# EAGLE schematic display_array (EAGLE 7.5.0)
DRAWING_NUMBER: S001; DRAWN: Mario Blunk / Blunk electronic; PROJECT: CLOCK; STATUS: DEMO

## Sheet 1 of 16
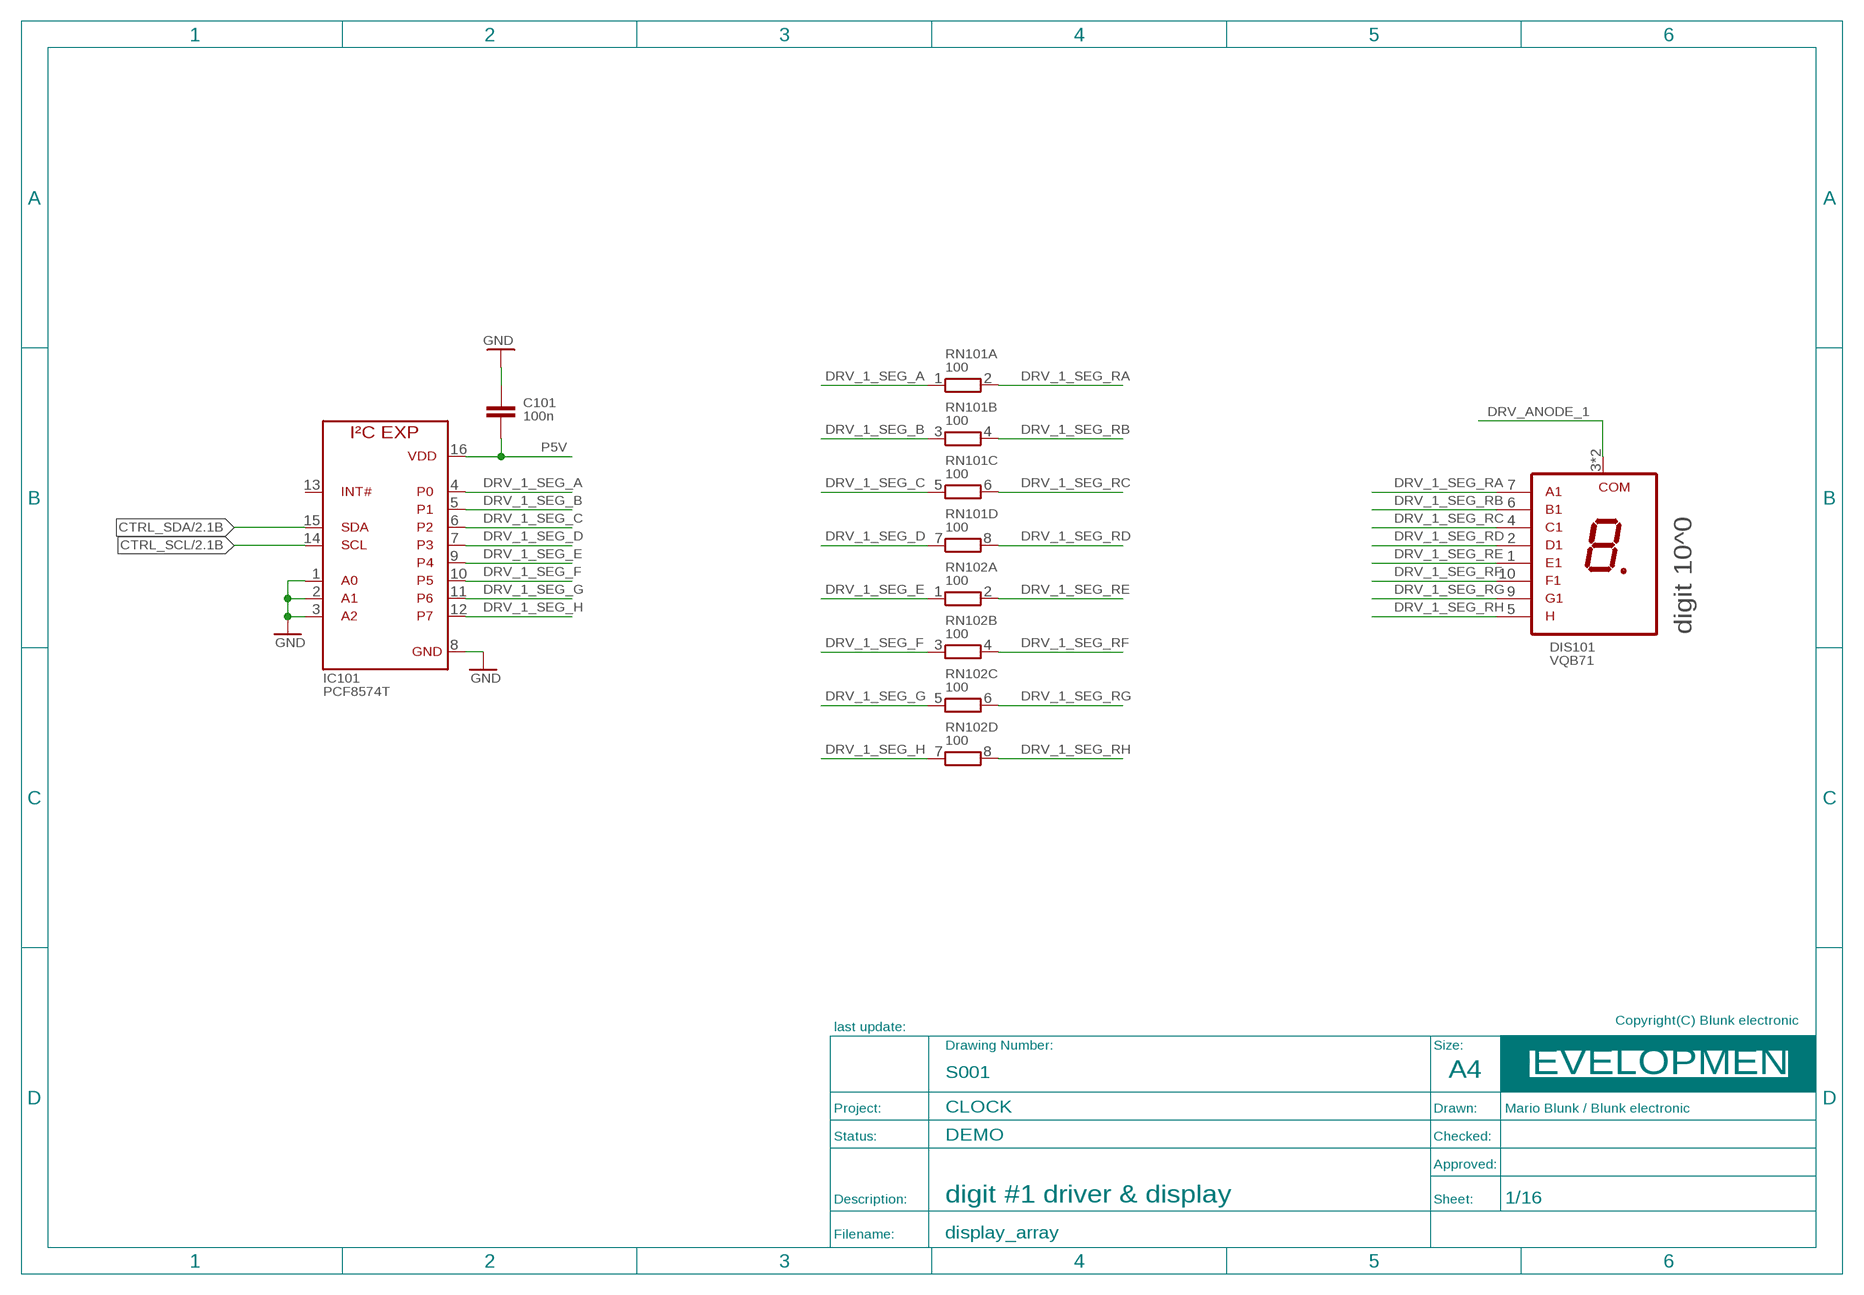
[diagram p0: schematic, sheet 1]
FRAME_PRODUCT1 (A4_LANDSCAPE_DEVELOPMENT): BOM: NO; COMMISSIONED: 2013-08-30; DESCRIPTION: digit #1 driver & display

### Parts
C101  100n  C_EU_S_0805  [S_0805]
DIS101  VQB71  [T_VQB71]
IC101  PCF8574T  [S_SOIC16]
RN101  100  R_EU_ARRAY_4  [T_SIL8]
RN102  100  R_EU_ARRAY_4  [T_SIL8]

### Nets
CTRL_SCL: IC101.14(SCL) ; also sheet 2,3,4,5,6,7,8,9,10,14
CTRL_SDA: IC101.15(SDA) ; also sheet 2,3,4,5,6,7,8,9,10,14
DRV_1_SEG_A: IC101.4(P0) RN101.1
DRV_1_SEG_B: IC101.5(P1) RN101.3
DRV_1_SEG_C: IC101.6(P2) RN101.5
DRV_1_SEG_D: IC101.7(P3) RN101.7
DRV_1_SEG_E: IC101.9(P4) RN102.1
DRV_1_SEG_F: IC101.10(P5) RN102.3
DRV_1_SEG_G: IC101.11(P6) RN102.5
DRV_1_SEG_H: IC101.12(P7) RN102.7
DRV_1_SEG_RA: DIS101.7(A1) RN101.2
DRV_1_SEG_RB: DIS101.6(B1) RN101.4
DRV_1_SEG_RC: DIS101.4(C1) RN101.6
DRV_1_SEG_RD: DIS101.2(D1) RN101.8
DRV_1_SEG_RE: DIS101.1(E1) RN102.2
DRV_1_SEG_RF: DIS101.10(F1) RN102.4
DRV_1_SEG_RG: DIS101.9(G1) RN102.6
DRV_1_SEG_RH: DIS101.5(DP1) RN102.8
DRV_ANODE_1 [pwr]: DIS101.3(COM1) DIS101.8(COM1) ; also sheet 2,3,4,9,16
GND [pwr]: C101.1 IC101.1(A0) IC101.2(A1) IC101.3(A2) IC101.8(GND) ; also sheet 2,3,4,5,6,7,8,9,10,11,12,13,14,15,16
P5V [pwr]: C101.2 IC101.16(VDD) ; also sheet 2,3,4,5,6,7,8,9,10,12,13,14,16
Unconnected: IC101.13(!INT)

## Sheet 2 of 16
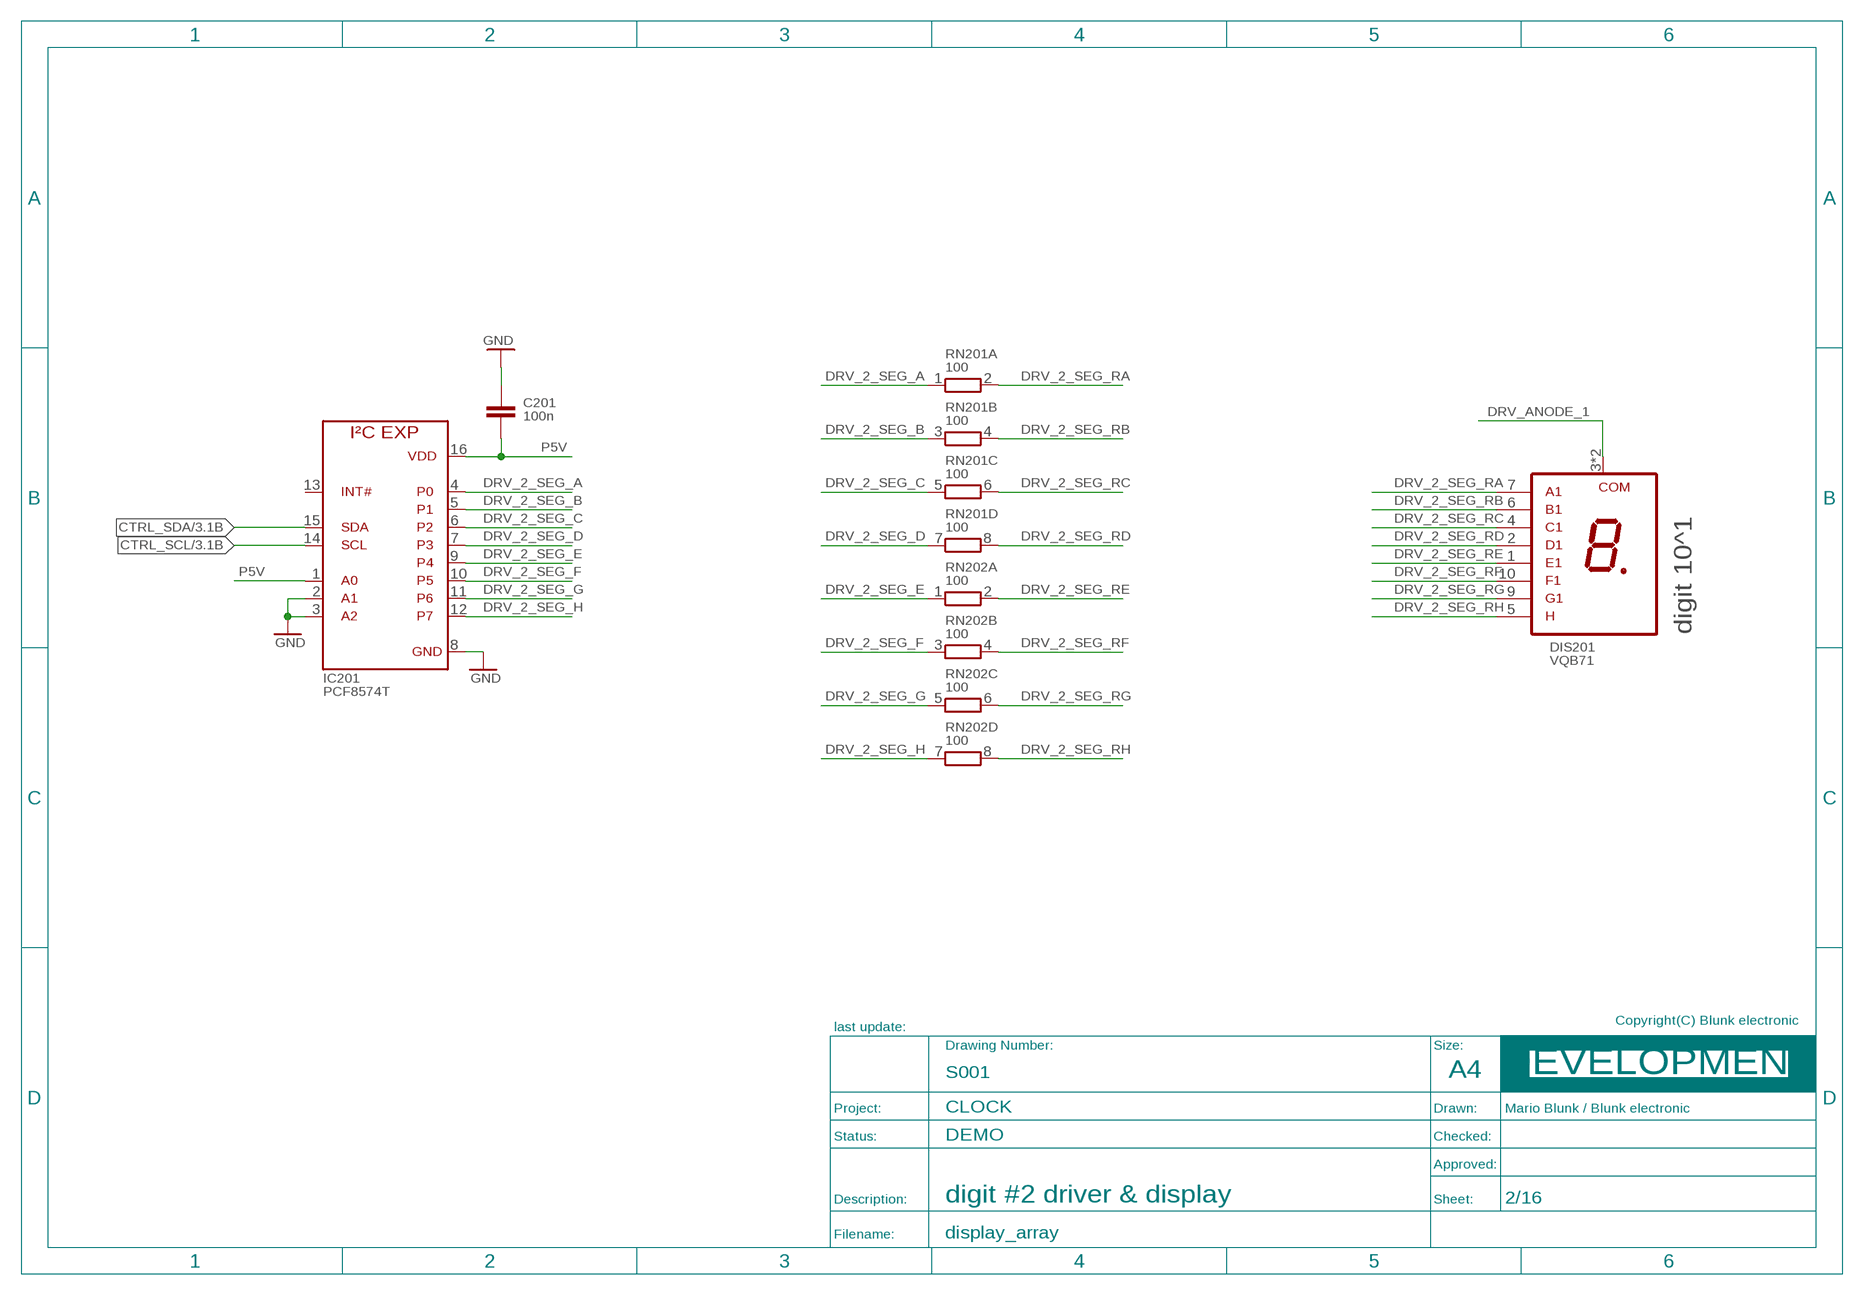
[diagram p1: schematic, sheet 2]
FRAME_PRODUCT2 (A4_LANDSCAPE_DEVELOPMENT): BOM: NO; COMMISSIONED: 2013-08-30; DESCRIPTION: digit #2 driver & display

### Parts
C201  100n  C_EU_S_0805  [S_0805]
DIS201  VQB71  [T_VQB71]
IC201  PCF8574T  [S_SOIC16]
RN201  100  R_EU_ARRAY_4  [T_SIL8]
RN202  100  R_EU_ARRAY_4  [T_SIL8]

### Nets
CTRL_SCL: IC201.14(SCL) ; also sheet 1,3,4,5,6,7,8,9,10,14
CTRL_SDA: IC201.15(SDA) ; also sheet 1,3,4,5,6,7,8,9,10,14
DRV_2_SEG_A: IC201.4(P0) RN201.1
DRV_2_SEG_B: IC201.5(P1) RN201.3
DRV_2_SEG_C: IC201.6(P2) RN201.5
DRV_2_SEG_D: IC201.7(P3) RN201.7
DRV_2_SEG_E: IC201.9(P4) RN202.1
DRV_2_SEG_F: IC201.10(P5) RN202.3
DRV_2_SEG_G: IC201.11(P6) RN202.5
DRV_2_SEG_H: IC201.12(P7) RN202.7
DRV_2_SEG_RA: DIS201.7(A1) RN201.2
DRV_2_SEG_RB: DIS201.6(B1) RN201.4
DRV_2_SEG_RC: DIS201.4(C1) RN201.6
DRV_2_SEG_RD: DIS201.2(D1) RN201.8
DRV_2_SEG_RE: DIS201.1(E1) RN202.2
DRV_2_SEG_RF: DIS201.10(F1) RN202.4
DRV_2_SEG_RG: DIS201.9(G1) RN202.6
DRV_2_SEG_RH: DIS201.5(DP1) RN202.8
DRV_ANODE_1 [pwr]: DIS201.3(COM1) DIS201.8(COM1) ; also sheet 1,3,4,9,16
GND [pwr]: C201.1 IC201.2(A1) IC201.3(A2) IC201.8(GND) ; also sheet 1,3,4,5,6,7,8,9,10,11,12,13,14,15,16
P5V [pwr]: C201.2 IC201.1(A0) IC201.16(VDD) ; also sheet 1,3,4,5,6,7,8,9,10,12,13,14,16
Unconnected: IC201.13(!INT)

## Sheet 3 of 16
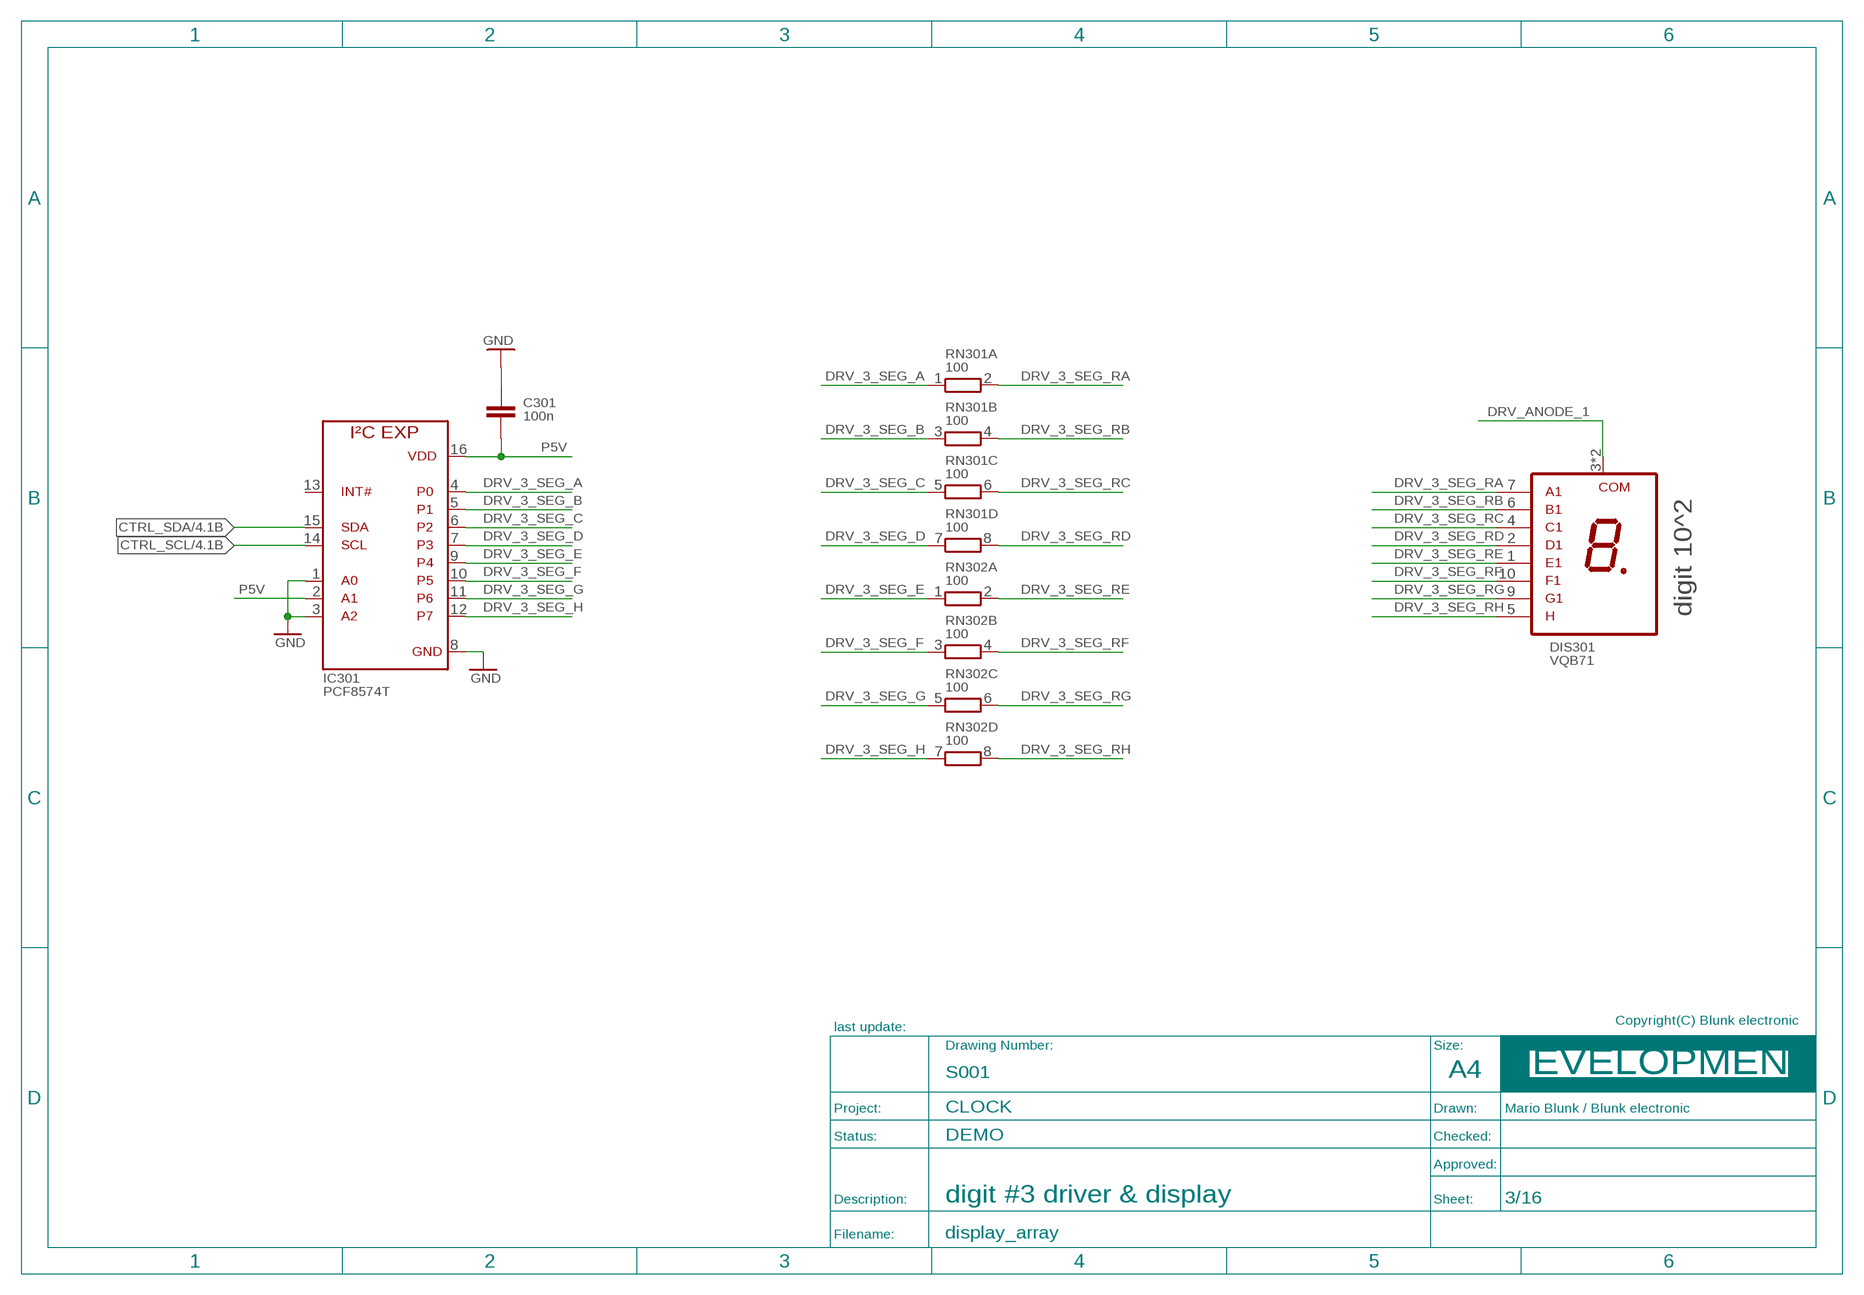
[diagram p2: schematic, sheet 3]
FRAME_PRODUCT3 (A4_LANDSCAPE_DEVELOPMENT): BOM: NO; COMMISSIONED: 2013-08-30; DESCRIPTION: digit #3 driver & display

### Parts
C301  100n  C_EU_S_0805  [S_0805]
DIS301  VQB71  [T_VQB71]
IC301  PCF8574T  [S_SOIC16]
RN301  100  R_EU_ARRAY_4  [T_SIL8]
RN302  100  R_EU_ARRAY_4  [T_SIL8]

### Nets
CTRL_SCL: IC301.14(SCL) ; also sheet 1,2,4,5,6,7,8,9,10,14
CTRL_SDA: IC301.15(SDA) ; also sheet 1,2,4,5,6,7,8,9,10,14
DRV_3_SEG_A: IC301.4(P0) RN301.1
DRV_3_SEG_B: IC301.5(P1) RN301.3
DRV_3_SEG_C: IC301.6(P2) RN301.5
DRV_3_SEG_D: IC301.7(P3) RN301.7
DRV_3_SEG_E: IC301.9(P4) RN302.1
DRV_3_SEG_F: IC301.10(P5) RN302.3
DRV_3_SEG_G: IC301.11(P6) RN302.5
DRV_3_SEG_H: IC301.12(P7) RN302.7
DRV_3_SEG_RA: DIS301.7(A1) RN301.2
DRV_3_SEG_RB: DIS301.6(B1) RN301.4
DRV_3_SEG_RC: DIS301.4(C1) RN301.6
DRV_3_SEG_RD: DIS301.2(D1) RN301.8
DRV_3_SEG_RE: DIS301.1(E1) RN302.2
DRV_3_SEG_RF: DIS301.10(F1) RN302.4
DRV_3_SEG_RG: DIS301.9(G1) RN302.6
DRV_3_SEG_RH: DIS301.5(DP1) RN302.8
DRV_ANODE_1 [pwr]: DIS301.3(COM1) DIS301.8(COM1) ; also sheet 1,2,4,9,16
GND [pwr]: C301.1 IC301.1(A0) IC301.3(A2) IC301.8(GND) ; also sheet 1,2,4,5,6,7,8,9,10,11,12,13,14,15,16
P5V [pwr]: C301.2 IC301.2(A1) IC301.16(VDD) ; also sheet 1,2,4,5,6,7,8,9,10,12,13,14,16
Unconnected: IC301.13(!INT)

## Sheet 4 of 16
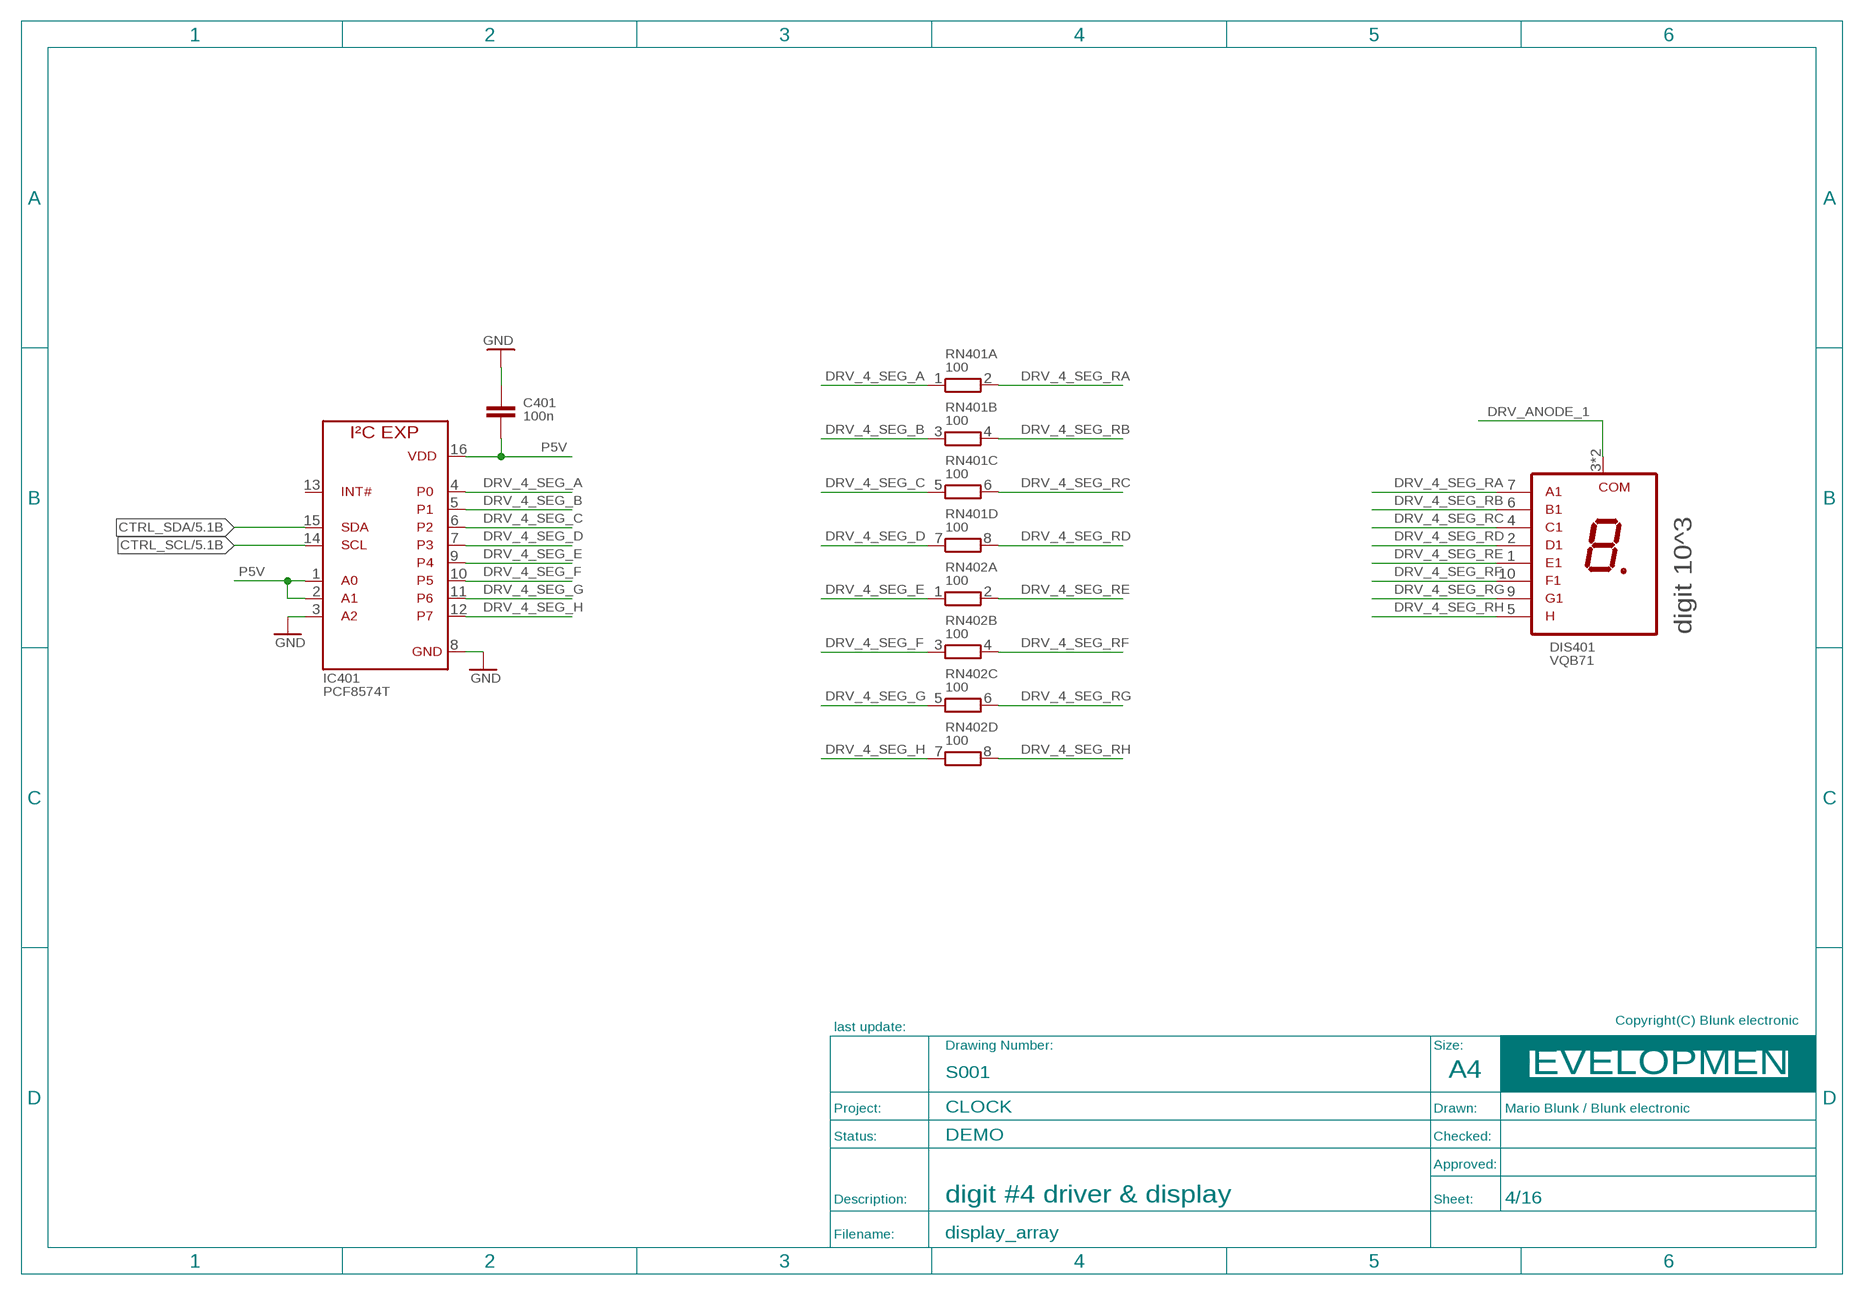
[diagram p3: schematic, sheet 4]
FRAME_PRODUCT4 (A4_LANDSCAPE_DEVELOPMENT): BOM: NO; COMMISSIONED: 2013-08-30; DESCRIPTION: digit #4 driver & display

### Parts
C401  100n  C_EU_S_0805  [S_0805]
DIS401  VQB71  [T_VQB71]
IC401  PCF8574T  [S_SOIC16]
RN401  100  R_EU_ARRAY_4  [T_SIL8]
RN402  100  R_EU_ARRAY_4  [T_SIL8]

### Nets
CTRL_SCL: IC401.14(SCL) ; also sheet 1,2,3,5,6,7,8,9,10,14
CTRL_SDA: IC401.15(SDA) ; also sheet 1,2,3,5,6,7,8,9,10,14
DRV_4_SEG_A: IC401.4(P0) RN401.1
DRV_4_SEG_B: IC401.5(P1) RN401.3
DRV_4_SEG_C: IC401.6(P2) RN401.5
DRV_4_SEG_D: IC401.7(P3) RN401.7
DRV_4_SEG_E: IC401.9(P4) RN402.1
DRV_4_SEG_F: IC401.10(P5) RN402.3
DRV_4_SEG_G: IC401.11(P6) RN402.5
DRV_4_SEG_H: IC401.12(P7) RN402.7
DRV_4_SEG_RA: DIS401.7(A1) RN401.2
DRV_4_SEG_RB: DIS401.6(B1) RN401.4
DRV_4_SEG_RC: DIS401.4(C1) RN401.6
DRV_4_SEG_RD: DIS401.2(D1) RN401.8
DRV_4_SEG_RE: DIS401.1(E1) RN402.2
DRV_4_SEG_RF: DIS401.10(F1) RN402.4
DRV_4_SEG_RG: DIS401.9(G1) RN402.6
DRV_4_SEG_RH: DIS401.5(DP1) RN402.8
DRV_ANODE_1 [pwr]: DIS401.3(COM1) DIS401.8(COM1) ; also sheet 1,2,3,9,16
GND [pwr]: C401.1 IC401.3(A2) IC401.8(GND) ; also sheet 1,2,3,5,6,7,8,9,10,11,12,13,14,15,16
P5V [pwr]: C401.2 IC401.1(A0) IC401.2(A1) IC401.16(VDD) ; also sheet 1,2,3,5,6,7,8,9,10,12,13,14,16
Unconnected: IC401.13(!INT)

## Sheet 5 of 16
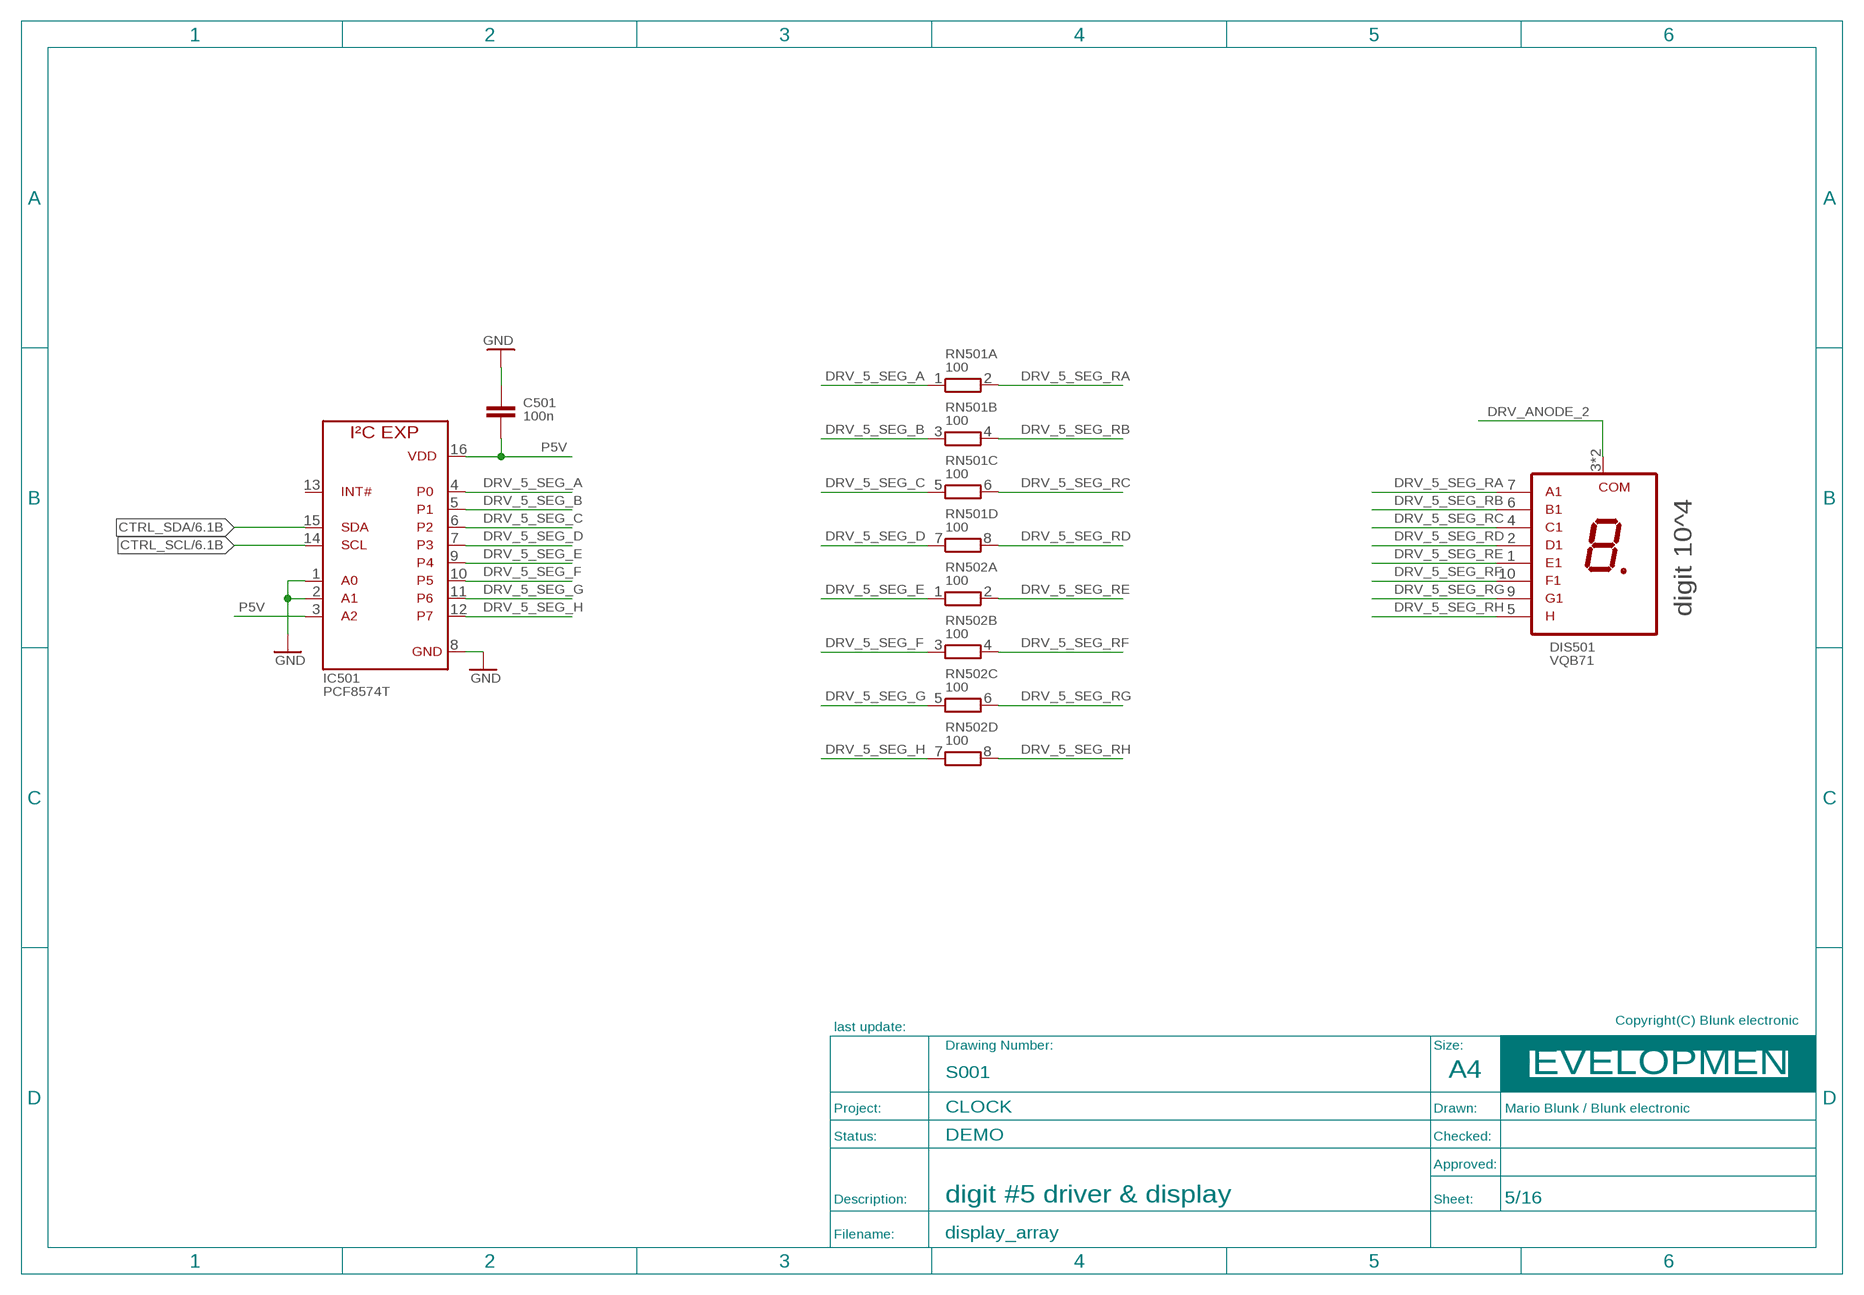
[diagram p4: schematic, sheet 5]
FRAME_PRODUCT5 (A4_LANDSCAPE_DEVELOPMENT): BOM: NO; COMMISSIONED: 2013-08-30; DESCRIPTION: digit #5 driver & display

### Parts
C501  100n  C_EU_S_0805  [S_0805]
DIS501  VQB71  [T_VQB71]
IC501  PCF8574T  [S_SOIC16]
RN501  100  R_EU_ARRAY_4  [T_SIL8]
RN502  100  R_EU_ARRAY_4  [T_SIL8]

### Nets
CTRL_SCL: IC501.14(SCL) ; also sheet 1,2,3,4,6,7,8,9,10,14
CTRL_SDA: IC501.15(SDA) ; also sheet 1,2,3,4,6,7,8,9,10,14
DRV_5_SEG_A: IC501.4(P0) RN501.1
DRV_5_SEG_B: IC501.5(P1) RN501.3
DRV_5_SEG_C: IC501.6(P2) RN501.5
DRV_5_SEG_D: IC501.7(P3) RN501.7
DRV_5_SEG_E: IC501.9(P4) RN502.1
DRV_5_SEG_F: IC501.10(P5) RN502.3
DRV_5_SEG_G: IC501.11(P6) RN502.5
DRV_5_SEG_H: IC501.12(P7) RN502.7
DRV_5_SEG_RA: DIS501.7(A1) RN501.2
DRV_5_SEG_RB: DIS501.6(B1) RN501.4
DRV_5_SEG_RC: DIS501.4(C1) RN501.6
DRV_5_SEG_RD: DIS501.2(D1) RN501.8
DRV_5_SEG_RE: DIS501.1(E1) RN502.2
DRV_5_SEG_RF: DIS501.10(F1) RN502.4
DRV_5_SEG_RG: DIS501.9(G1) RN502.6
DRV_5_SEG_RH: DIS501.5(DP1) RN502.8
DRV_ANODE_2 [pwr]: DIS501.3(COM1) DIS501.8(COM1) ; also sheet 6,7,8,14,16
GND [pwr]: C501.1 IC501.1(A0) IC501.2(A1) IC501.8(GND) ; also sheet 1,2,3,4,6,7,8,9,10,11,12,13,14,15,16
P5V [pwr]: C501.2 IC501.3(A2) IC501.16(VDD) ; also sheet 1,2,3,4,6,7,8,9,10,12,13,14,16
Unconnected: IC501.13(!INT)

## Sheet 6 of 16
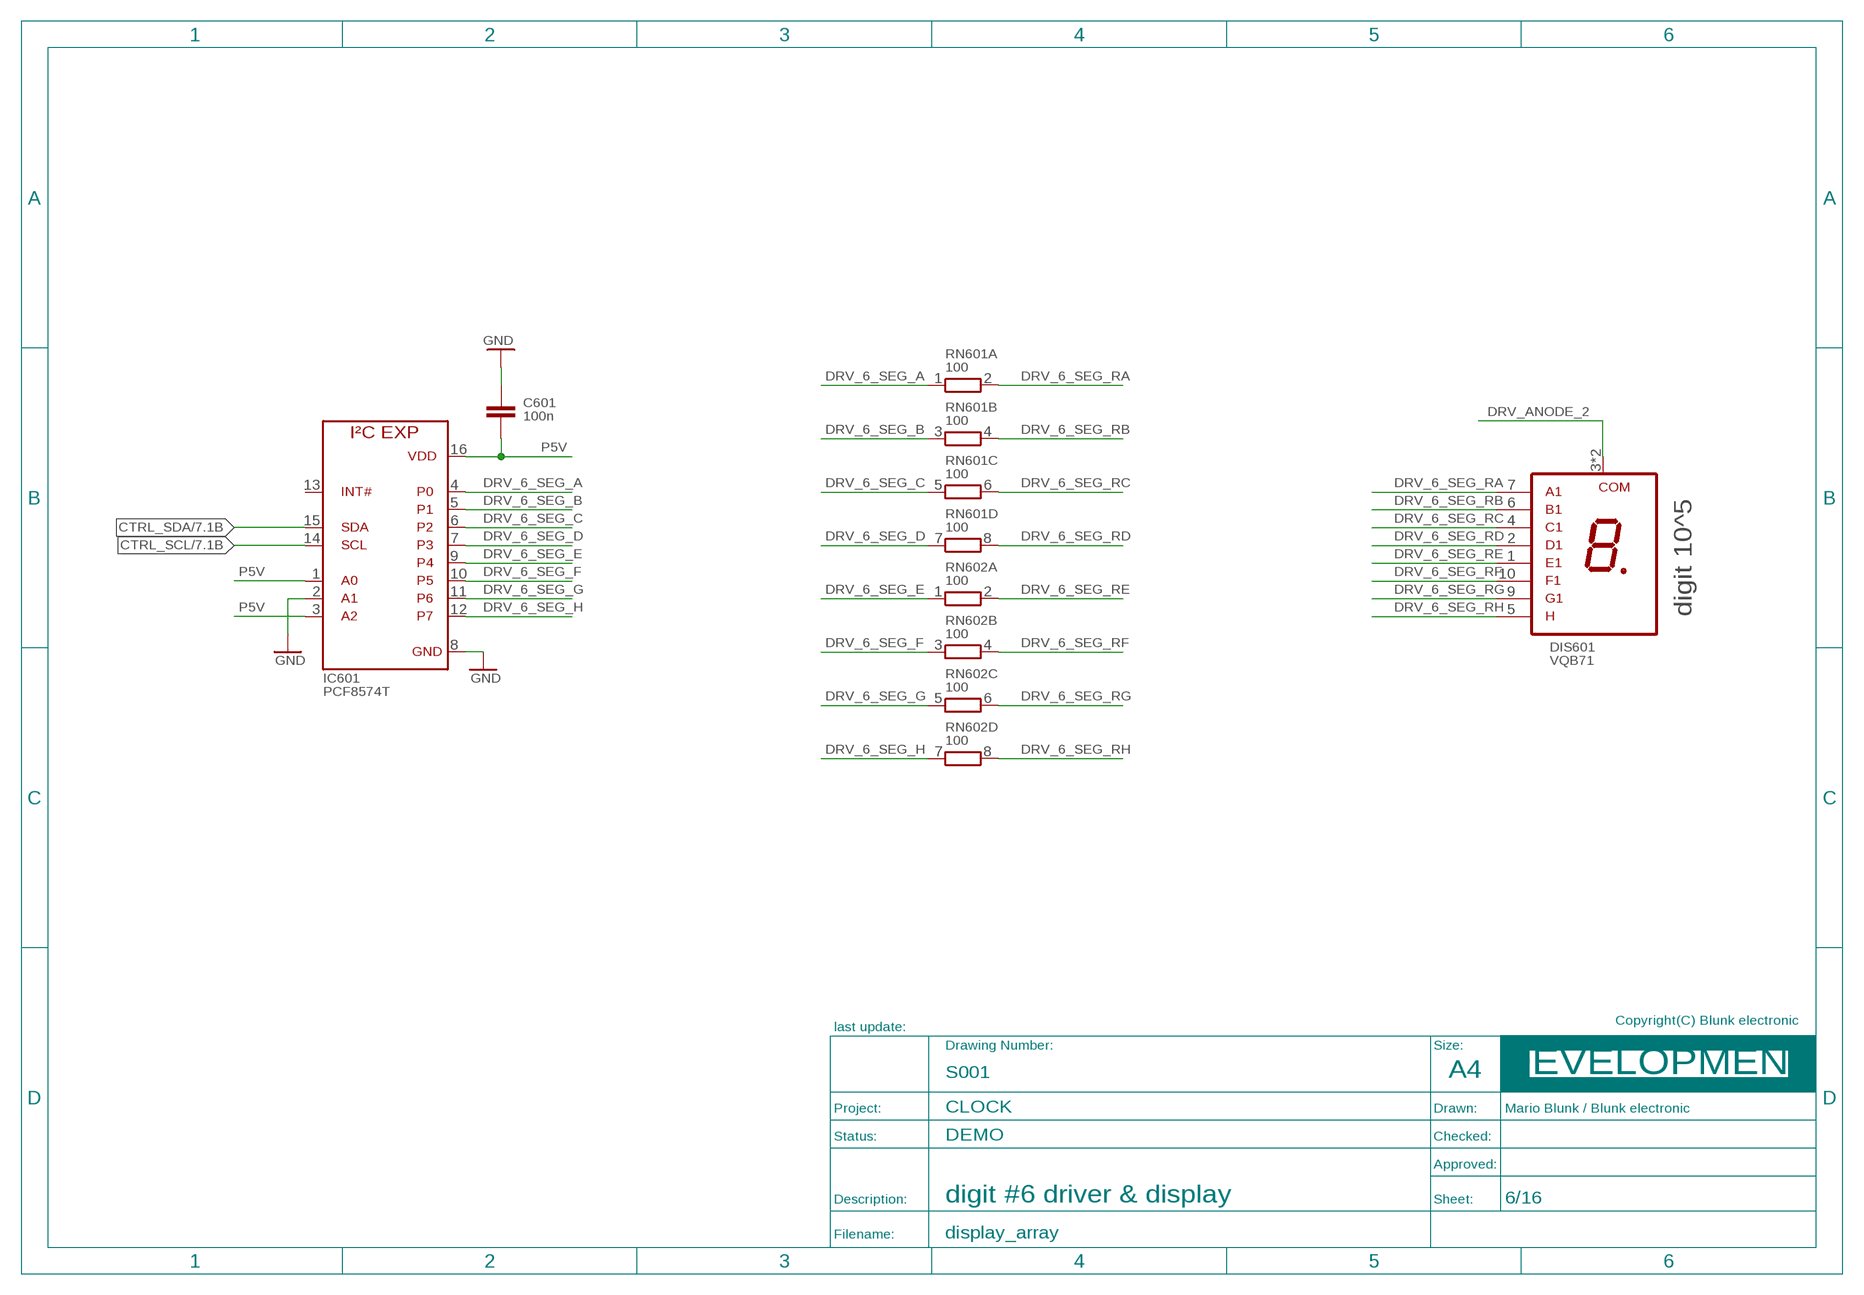
[diagram p5: schematic, sheet 6]
FRAME_PRODUCT6 (A4_LANDSCAPE_DEVELOPMENT): BOM: NO; COMMISSIONED: 2013-08-30; DESCRIPTION: digit #6 driver & display

### Parts
C601  100n  C_EU_S_0805  [S_0805]
DIS601  VQB71  [T_VQB71]
IC601  PCF8574T  [S_SOIC16]
RN601  100  R_EU_ARRAY_4  [T_SIL8]
RN602  100  R_EU_ARRAY_4  [T_SIL8]

### Nets
CTRL_SCL: IC601.14(SCL) ; also sheet 1,2,3,4,5,7,8,9,10,14
CTRL_SDA: IC601.15(SDA) ; also sheet 1,2,3,4,5,7,8,9,10,14
DRV_6_SEG_A: IC601.4(P0) RN601.1
DRV_6_SEG_B: IC601.5(P1) RN601.3
DRV_6_SEG_C: IC601.6(P2) RN601.5
DRV_6_SEG_D: IC601.7(P3) RN601.7
DRV_6_SEG_E: IC601.9(P4) RN602.1
DRV_6_SEG_F: IC601.10(P5) RN602.3
DRV_6_SEG_G: IC601.11(P6) RN602.5
DRV_6_SEG_H: IC601.12(P7) RN602.7
DRV_6_SEG_RA: DIS601.7(A1) RN601.2
DRV_6_SEG_RB: DIS601.6(B1) RN601.4
DRV_6_SEG_RC: DIS601.4(C1) RN601.6
DRV_6_SEG_RD: DIS601.2(D1) RN601.8
DRV_6_SEG_RE: DIS601.1(E1) RN602.2
DRV_6_SEG_RF: DIS601.10(F1) RN602.4
DRV_6_SEG_RG: DIS601.9(G1) RN602.6
DRV_6_SEG_RH: DIS601.5(DP1) RN602.8
DRV_ANODE_2 [pwr]: DIS601.3(COM1) DIS601.8(COM1) ; also sheet 5,7,8,14,16
GND [pwr]: C601.1 IC601.2(A1) IC601.8(GND) ; also sheet 1,2,3,4,5,7,8,9,10,11,12,13,14,15,16
P5V [pwr]: C601.2 IC601.1(A0) IC601.3(A2) IC601.16(VDD) ; also sheet 1,2,3,4,5,7,8,9,10,12,13,14,16
Unconnected: IC601.13(!INT)

## Sheet 7 of 16
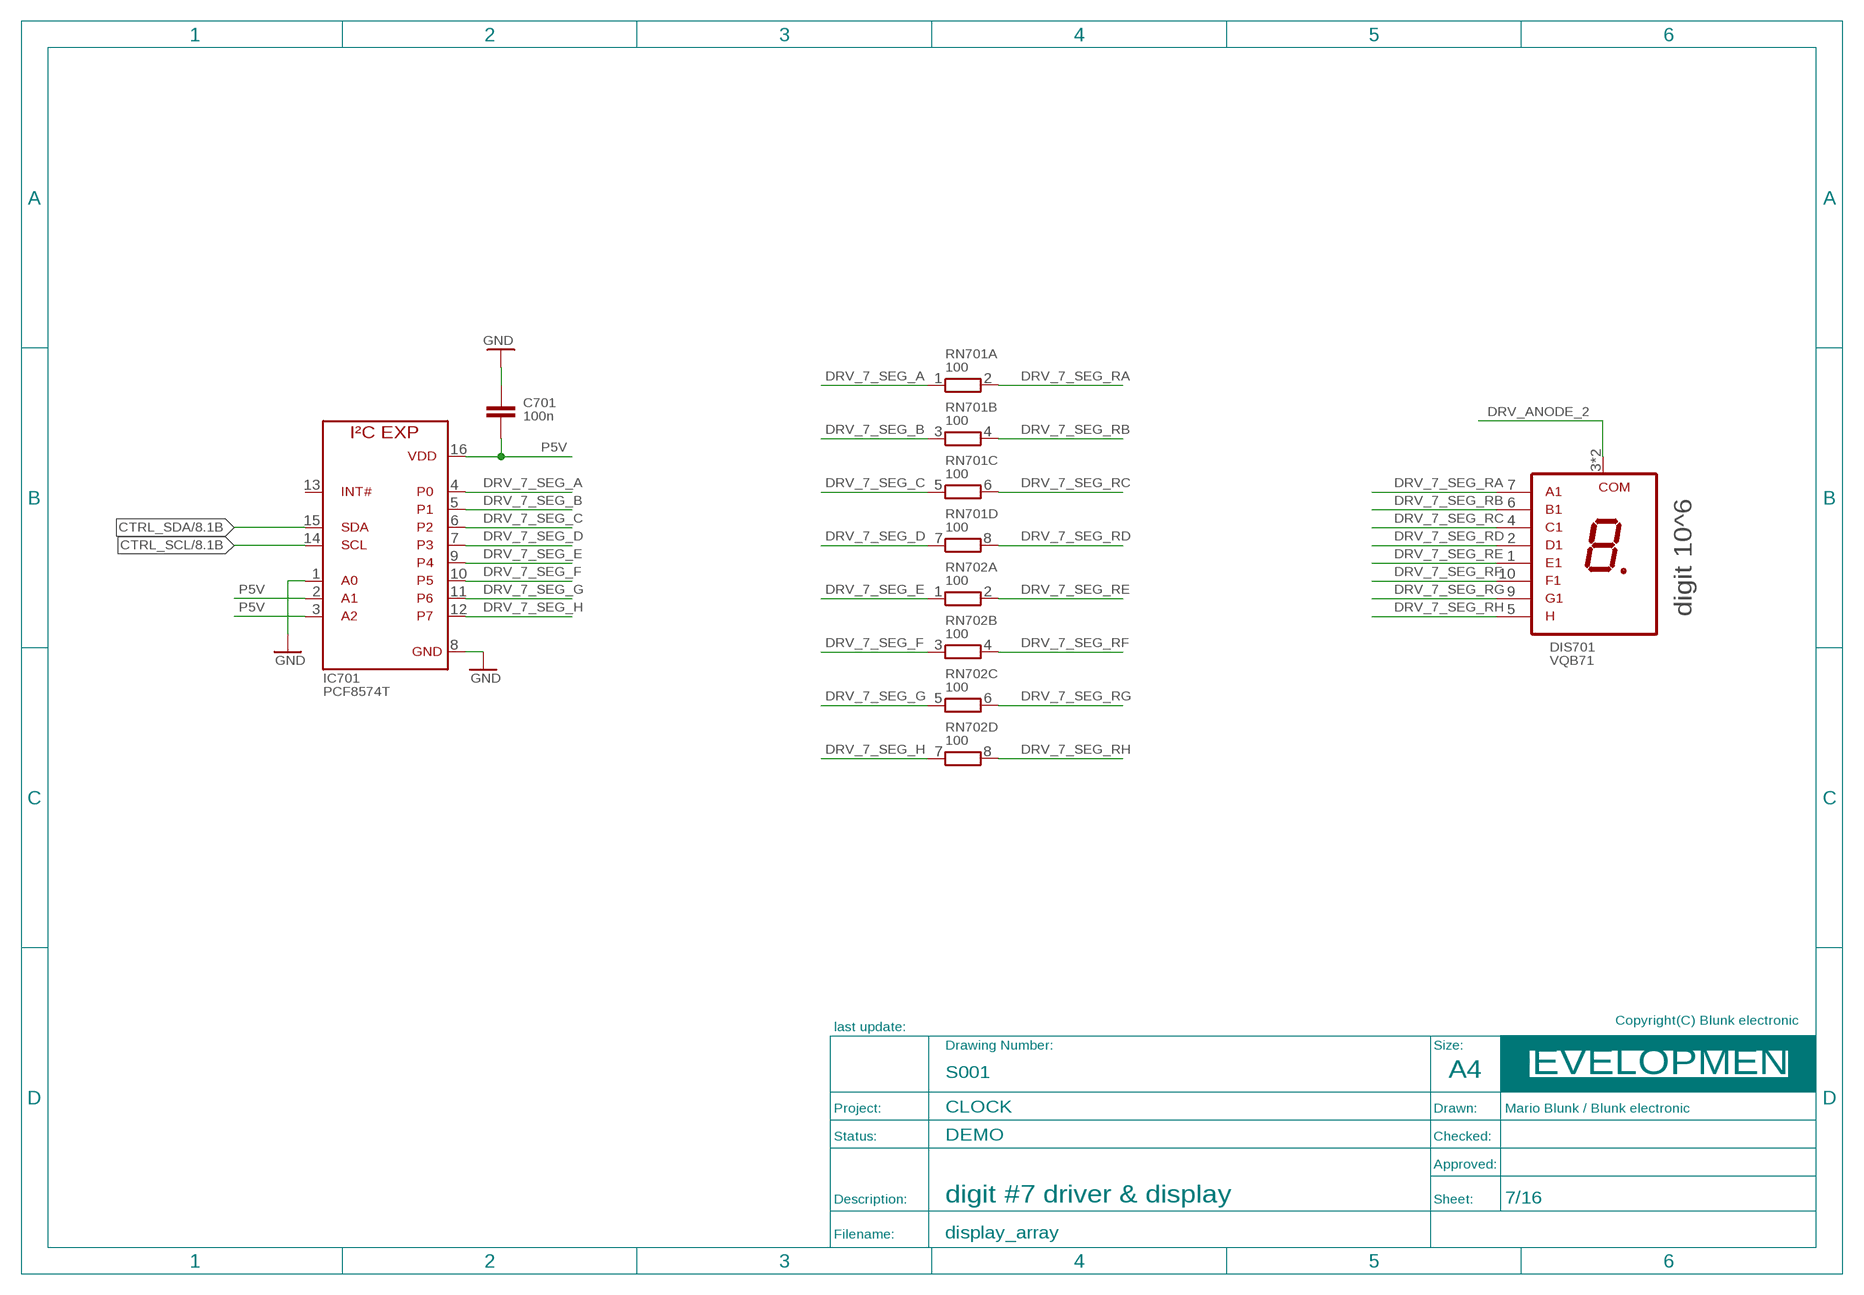
[diagram p6: schematic, sheet 7]
FRAME_PRODUCT7 (A4_LANDSCAPE_DEVELOPMENT): BOM: NO; COMMISSIONED: 2013-08-30; DESCRIPTION: digit #7 driver & display

### Parts
C701  100n  C_EU_S_0805  [S_0805]
DIS701  VQB71  [T_VQB71]
IC701  PCF8574T  [S_SOIC16]
RN701  100  R_EU_ARRAY_4  [T_SIL8]
RN702  100  R_EU_ARRAY_4  [T_SIL8]

### Nets
CTRL_SCL: IC701.14(SCL) ; also sheet 1,2,3,4,5,6,8,9,10,14
CTRL_SDA: IC701.15(SDA) ; also sheet 1,2,3,4,5,6,8,9,10,14
DRV_7_SEG_A: IC701.4(P0) RN701.1
DRV_7_SEG_B: IC701.5(P1) RN701.3
DRV_7_SEG_C: IC701.6(P2) RN701.5
DRV_7_SEG_D: IC701.7(P3) RN701.7
DRV_7_SEG_E: IC701.9(P4) RN702.1
DRV_7_SEG_F: IC701.10(P5) RN702.3
DRV_7_SEG_G: IC701.11(P6) RN702.5
DRV_7_SEG_H: IC701.12(P7) RN702.7
DRV_7_SEG_RA: DIS701.7(A1) RN701.2
DRV_7_SEG_RB: DIS701.6(B1) RN701.4
DRV_7_SEG_RC: DIS701.4(C1) RN701.6
DRV_7_SEG_RD: DIS701.2(D1) RN701.8
DRV_7_SEG_RE: DIS701.1(E1) RN702.2
DRV_7_SEG_RF: DIS701.10(F1) RN702.4
DRV_7_SEG_RG: DIS701.9(G1) RN702.6
DRV_7_SEG_RH: DIS701.5(DP1) RN702.8
DRV_ANODE_2 [pwr]: DIS701.3(COM1) DIS701.8(COM1) ; also sheet 5,6,8,14,16
GND [pwr]: C701.1 IC701.1(A0) IC701.8(GND) ; also sheet 1,2,3,4,5,6,8,9,10,11,12,13,14,15,16
P5V [pwr]: C701.2 IC701.2(A1) IC701.3(A2) IC701.16(VDD) ; also sheet 1,2,3,4,5,6,8,9,10,12,13,14,16
Unconnected: IC701.13(!INT)

## Sheet 8 of 16
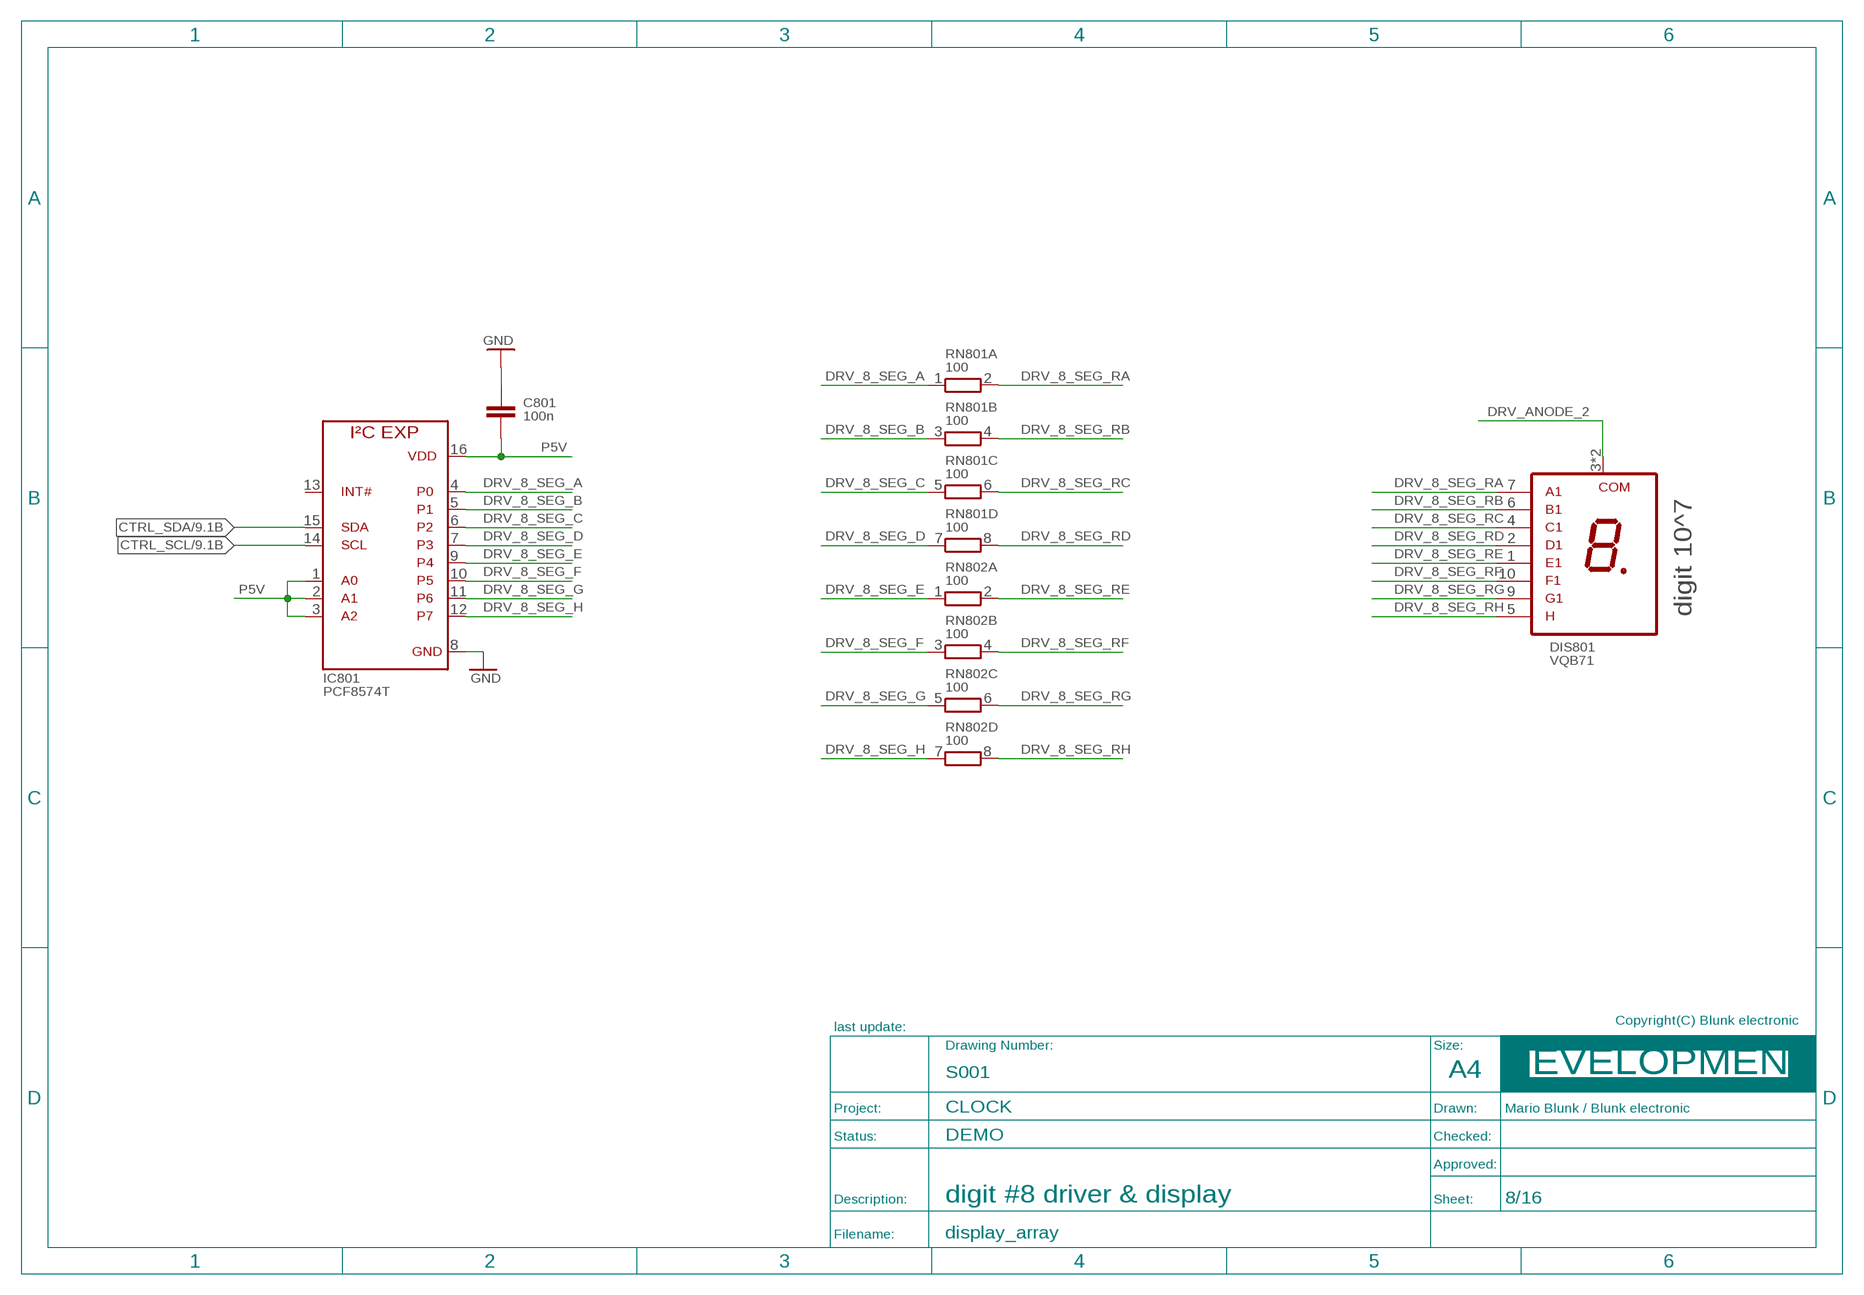
[diagram p7: schematic, sheet 8]
FRAME_PRODUCT8 (A4_LANDSCAPE_DEVELOPMENT): BOM: NO; COMMISSIONED: 2013-08-30; DESCRIPTION: digit #8 driver & display

### Parts
C801  100n  C_EU_S_0805  [S_0805]
DIS801  VQB71  [T_VQB71]
IC801  PCF8574T  [S_SOIC16]
RN801  100  R_EU_ARRAY_4  [T_SIL8]
RN802  100  R_EU_ARRAY_4  [T_SIL8]

### Nets
CTRL_SCL: IC801.14(SCL) ; also sheet 1,2,3,4,5,6,7,9,10,14
CTRL_SDA: IC801.15(SDA) ; also sheet 1,2,3,4,5,6,7,9,10,14
DRV_8_SEG_A: IC801.4(P0) RN801.1
DRV_8_SEG_B: IC801.5(P1) RN801.3
DRV_8_SEG_C: IC801.6(P2) RN801.5
DRV_8_SEG_D: IC801.7(P3) RN801.7
DRV_8_SEG_E: IC801.9(P4) RN802.1
DRV_8_SEG_F: IC801.10(P5) RN802.3
DRV_8_SEG_G: IC801.11(P6) RN802.5
DRV_8_SEG_H: IC801.12(P7) RN802.7
DRV_8_SEG_RA: DIS801.7(A1) RN801.2
DRV_8_SEG_RB: DIS801.6(B1) RN801.4
DRV_8_SEG_RC: DIS801.4(C1) RN801.6
DRV_8_SEG_RD: DIS801.2(D1) RN801.8
DRV_8_SEG_RE: DIS801.1(E1) RN802.2
DRV_8_SEG_RF: DIS801.10(F1) RN802.4
DRV_8_SEG_RG: DIS801.9(G1) RN802.6
DRV_8_SEG_RH: DIS801.5(DP1) RN802.8
DRV_ANODE_2 [pwr]: DIS801.3(COM1) DIS801.8(COM1) ; also sheet 5,6,7,14,16
GND [pwr]: C801.1 IC801.8(GND) ; also sheet 1,2,3,4,5,6,7,9,10,11,12,13,14,15,16
P5V [pwr]: C801.2 IC801.1(A0) IC801.2(A1) IC801.3(A2) IC801.16(VDD) ; also sheet 1,2,3,4,5,6,7,9,10,12,13,14,16
Unconnected: IC801.13(!INT)

## Sheet 9 of 16
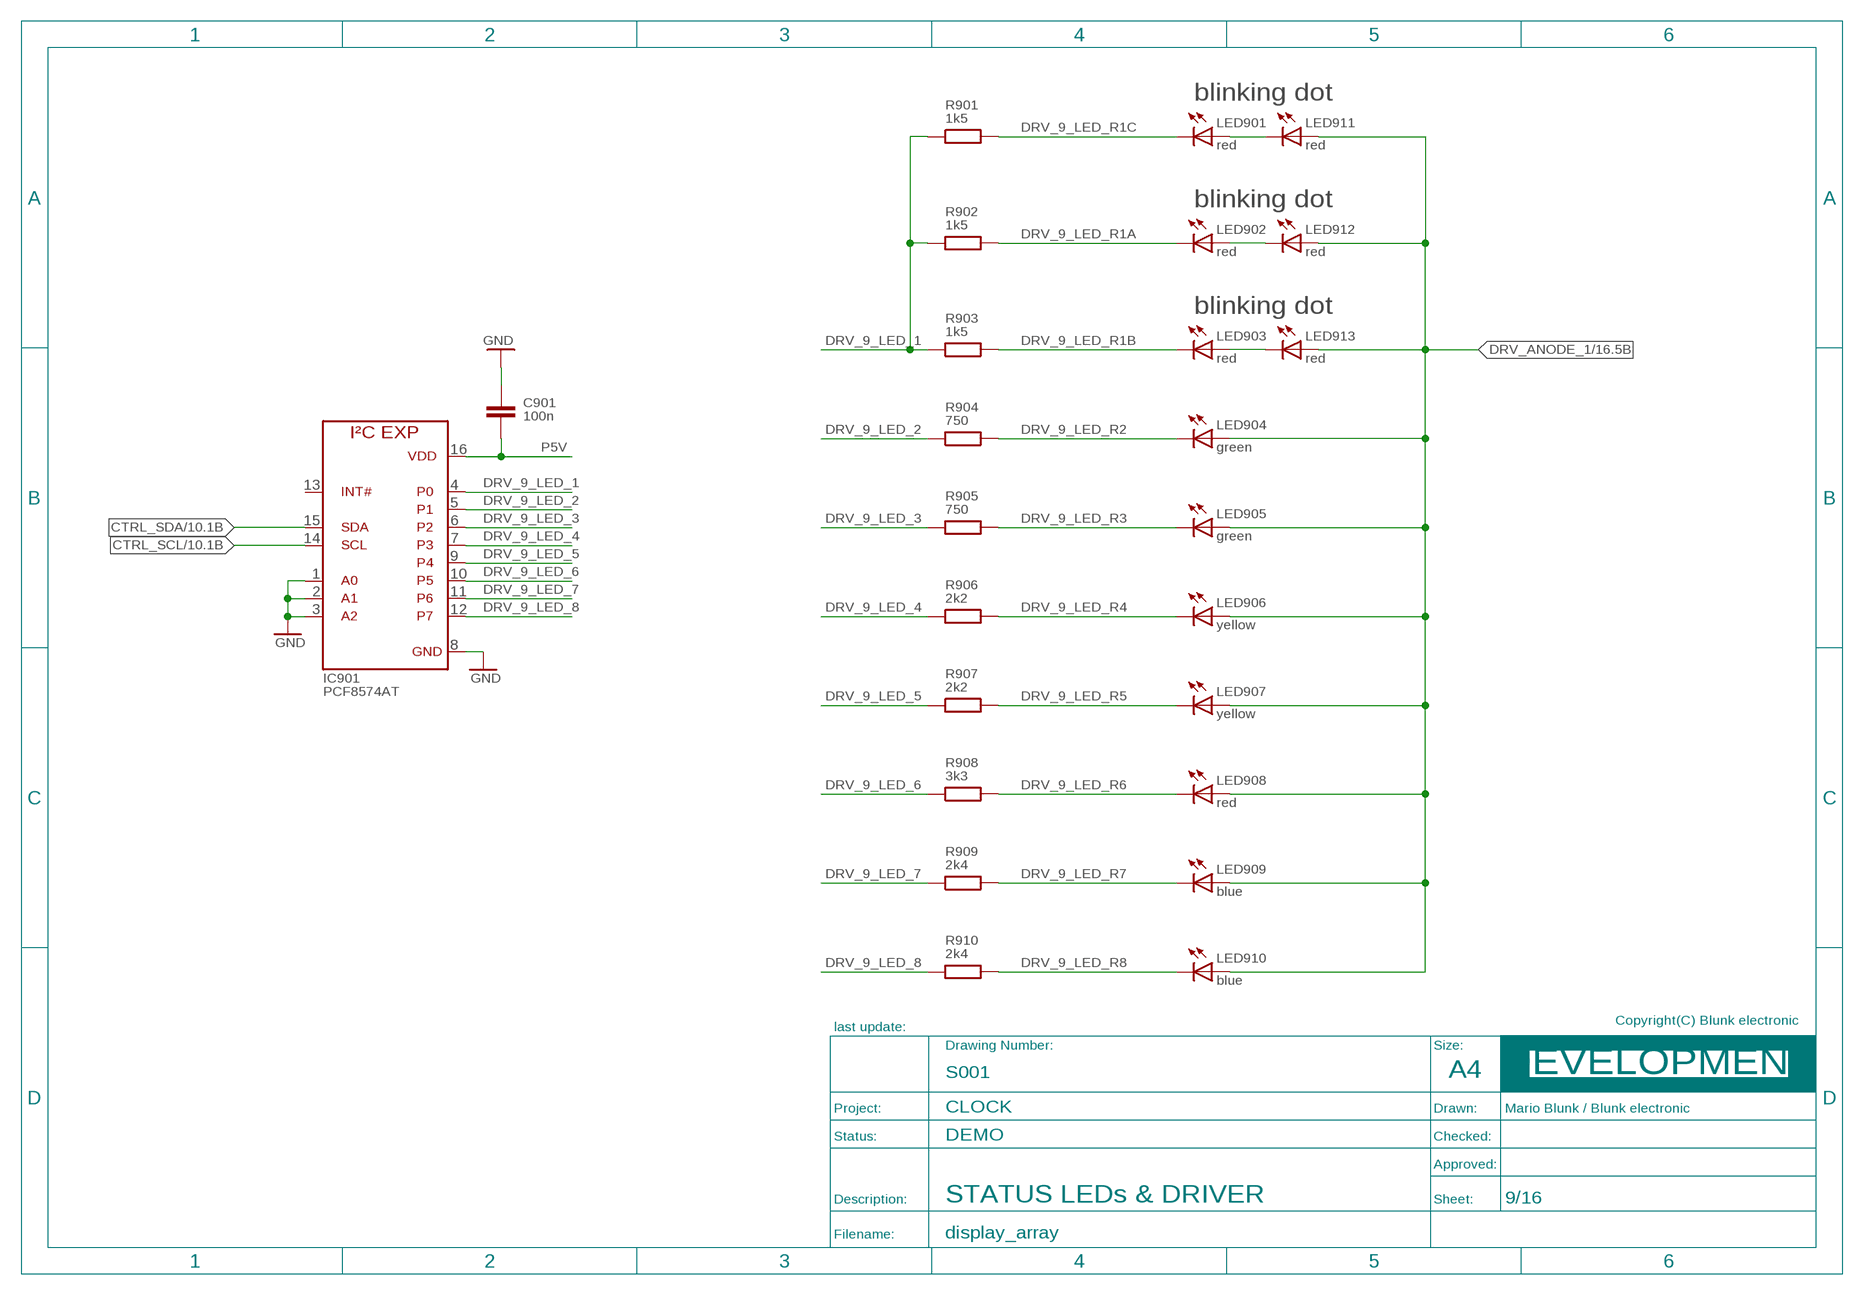
[diagram p8: schematic, sheet 9]
FRAME_DEVELOPMENT1 (A4_LANDSCAPE_DEVELOPMENT): BOM: NO; COMMISSIONED: 2013-08-30; DESCRIPTION: STATUS LEDs & DRIVER

### Parts
C901  100n  C_EU_S_0805  [S_0805]
IC901  PCF8574AT  PCF8574T  [S_SOIC16]
LED901  red  LED_S_0805  [S_0805]
LED902  red  LED_S_0805  [S_0805]
LED903  red  LED_S_0805  [S_0805]
LED904  green  LED_S_0805  [S_0805]
LED905  green  LED_S_0805  [S_0805]
LED906  yellow  LED_S_0805  [S_0805]
LED907  yellow  LED_S_0805  [S_0805]
LED908  red  LED_S_0805  [S_0805]
LED909  blue  LED_S_0805  [S_0805]
LED910  blue  LED_S_0805  [S_0805]
LED911  red  LED_S_0805  [S_0805]
LED912  red  LED_S_0805  [S_0805]
LED913  red  LED_S_0805  [S_0805]
R901  1k5  R_EU_S_0805  [S_0805]
R902  1k5  R_EU_S_0805  [S_0805]
R903  1k5  R_EU_S_0805  [S_0805]
R904  750  R_EU_S_0805  [S_0805]
R905  750  R_EU_S_0805  [S_0805]
R906  2k2  R_EU_S_0805  [S_0805]
R907  2k2  R_EU_S_0805  [S_0805]
R908  3k3  R_EU_S_0805  [S_0805]
R909  2k4  R_EU_S_0805  [S_0805]
R910  2k4  R_EU_S_0805  [S_0805]

### Nets
CTRL_SCL: IC901.14(SCL) ; also sheet 1,2,3,4,5,6,7,8,10,14
CTRL_SDA: IC901.15(SDA) ; also sheet 1,2,3,4,5,6,7,8,10,14
DRV_9_LED_1: IC901.4(P0) R901.1 R902.1 R903.1
DRV_9_LED_2: IC901.5(P1) R904.1
DRV_9_LED_3: IC901.6(P2) R905.1
DRV_9_LED_4: IC901.7(P3) R906.1
DRV_9_LED_5: IC901.9(P4) R907.1
DRV_9_LED_6: IC901.10(P5) R908.1
DRV_9_LED_7: IC901.11(P6) R909.1
DRV_9_LED_8: IC901.12(P7) R910.1
DRV_9_LED_R1A: LED902.C R902.2
DRV_9_LED_R1AA: LED902.A LED912.C
DRV_9_LED_R1B: LED903.C R903.2
DRV_9_LED_R1BB: LED903.A LED913.C
DRV_9_LED_R1C: LED901.C R901.2
DRV_9_LED_R1CC: LED901.A LED911.C
DRV_9_LED_R2: LED904.C R904.2
DRV_9_LED_R3: LED905.C R905.2
DRV_9_LED_R4: LED906.C R906.2
DRV_9_LED_R5: LED907.C R907.2
DRV_9_LED_R6: LED908.C R908.2
DRV_9_LED_R7: LED909.C R909.2
DRV_9_LED_R8: LED910.C R910.2
DRV_ANODE_1 [pwr]: LED904.A LED905.A LED906.A LED907.A LED908.A LED909.A LED910.A LED911.A LED912.A LED913.A ; also sheet 1,2,3,4,16
GND [pwr]: C901.1 IC901.1(A0) IC901.2(A1) IC901.3(A2) IC901.8(GND) ; also sheet 1,2,3,4,5,6,7,8,10,11,12,13,14,15,16
P5V [pwr]: C901.2 IC901.16(VDD) ; also sheet 1,2,3,4,5,6,7,8,10,12,13,14,16
Unconnected: IC901.13(!INT)

## Sheet 10 of 16
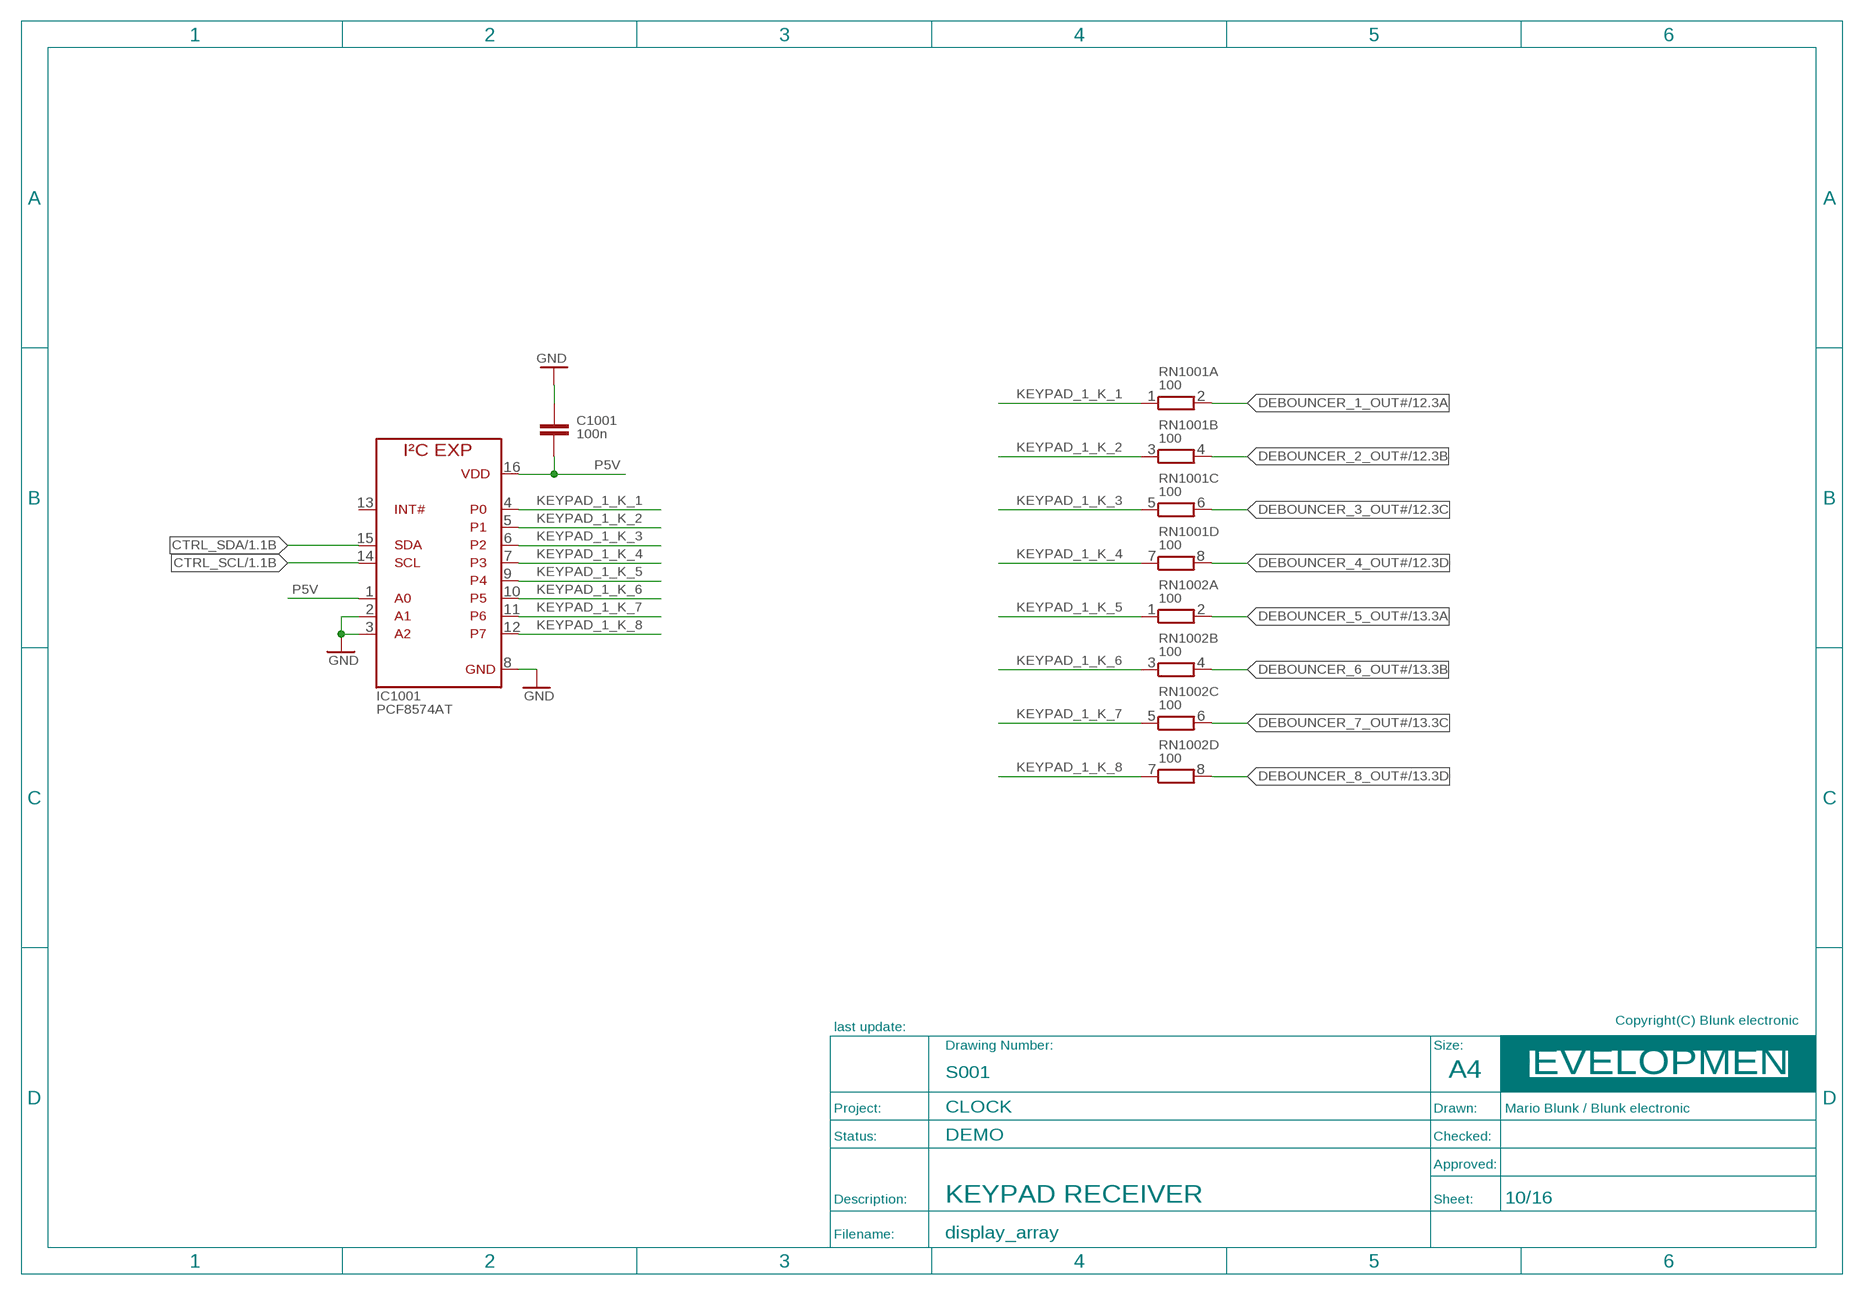
[diagram p9: schematic, sheet 10]
FRAME_DEVELOPMENT2 (A4_LANDSCAPE_DEVELOPMENT): BOM: NO; COMMISSIONED: 2013-08-30; DESCRIPTION: KEYPAD RECEIVER

### Parts
C1001  100n  C_EU_S_0805  [S_0805]
IC1001  PCF8574AT  PCF8574T  [S_SOIC16]
RN1001  100  R_EU_ARRAY_4  [T_SIL8]
RN1002  100  R_EU_ARRAY_4  [T_SIL8]

### Nets
CTRL_SCL: IC1001.14(SCL) ; also sheet 1,2,3,4,5,6,7,8,9,14
CTRL_SDA: IC1001.15(SDA) ; also sheet 1,2,3,4,5,6,7,8,9,14
DEBOUNCER_1_OUT#: RN1001.2 ; also sheet 12
DEBOUNCER_2_OUT#: RN1001.4 ; also sheet 12
DEBOUNCER_3_OUT#: RN1001.6 ; also sheet 12
DEBOUNCER_4_OUT#: RN1001.8 ; also sheet 12
DEBOUNCER_5_OUT#: RN1002.2 ; also sheet 13
DEBOUNCER_6_OUT#: RN1002.4 ; also sheet 13
DEBOUNCER_7_OUT#: RN1002.6 ; also sheet 13
DEBOUNCER_8_OUT#: RN1002.8 ; also sheet 13
GND [pwr]: C1001.1 IC1001.2(A1) IC1001.3(A2) IC1001.8(GND) ; also sheet 1,2,3,4,5,6,7,8,9,11,12,13,14,15,16
KEYPAD_1_K_1: IC1001.4(P0) RN1001.1
KEYPAD_1_K_2: IC1001.5(P1) RN1001.3
KEYPAD_1_K_3: IC1001.6(P2) RN1001.5
KEYPAD_1_K_4: IC1001.7(P3) RN1001.7
KEYPAD_1_K_5: IC1001.9(P4) RN1002.1
KEYPAD_1_K_6: IC1001.10(P5) RN1002.3
KEYPAD_1_K_7: IC1001.11(P6) RN1002.5
KEYPAD_1_K_8: IC1001.12(P7) RN1002.7
P5V [pwr]: C1001.2 IC1001.1(A0) IC1001.16(VDD) ; also sheet 1,2,3,4,5,6,7,8,9,12,13,14,16
Unconnected: IC1001.13(!INT)

## Sheet 11 of 16
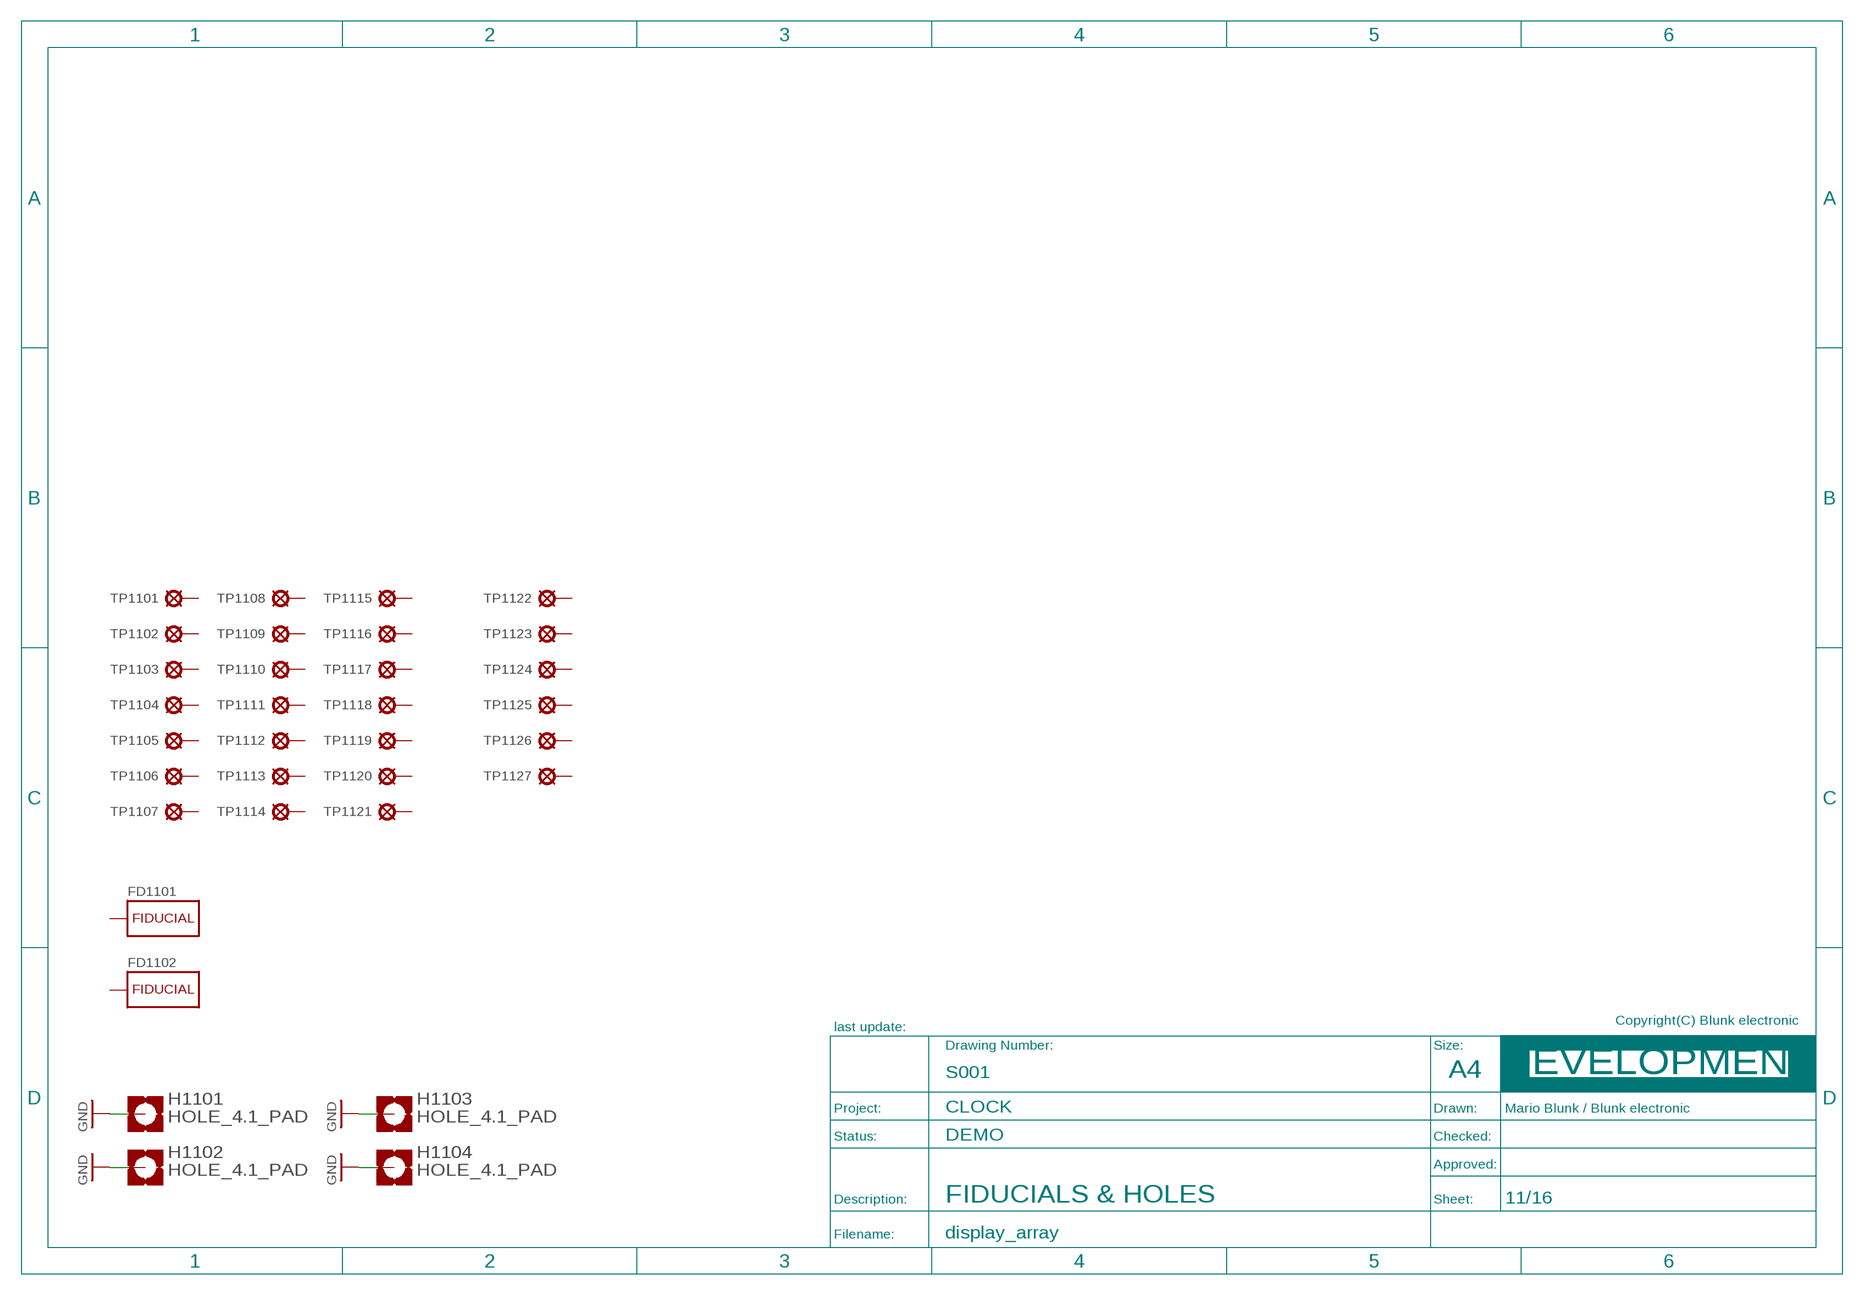
[diagram p10: schematic, sheet 11]
FRAME_DEVELOPMENT3 (A4_LANDSCAPE_DEVELOPMENT): BOM: NO; COMMISSIONED: 2013-08-30; DESCRIPTION: FIDUCIALS & HOLES

### Parts
FD1101  FIDUCIAL_CROSSHAIR  [CROSSHAIR]
FD1102  FIDUCIAL_CROSSHAIR  [CROSSHAIR]
H1101  HOLE_4.1_PAD  [4.1_PAD]
H1102  HOLE_4.1_PAD  [4.1_PAD]
H1103  HOLE_4.1_PAD  [4.1_PAD]
H1104  HOLE_4.1_PAD  [4.1_PAD]
TP1101  TEST_POINT_T_SMALL  [T_TEST_POINT_SMALL]
TP1102  TEST_POINT_T_SMALL  [T_TEST_POINT_SMALL]
TP1103  TEST_POINT_T_SMALL  [T_TEST_POINT_SMALL]
TP1104  TEST_POINT_T_SMALL  [T_TEST_POINT_SMALL]
TP1105  TEST_POINT_T_SMALL  [T_TEST_POINT_SMALL]
TP1106  TEST_POINT_T_SMALL  [T_TEST_POINT_SMALL]
TP1107  TEST_POINT_T_SMALL  [T_TEST_POINT_SMALL]
TP1108  TEST_POINT_T_SMALL  [T_TEST_POINT_SMALL]
TP1109  TEST_POINT_T_SMALL  [T_TEST_POINT_SMALL]
TP1110  TEST_POINT_T_SMALL  [T_TEST_POINT_SMALL]
TP1111  TEST_POINT_T_SMALL  [T_TEST_POINT_SMALL]
TP1112  TEST_POINT_T_SMALL  [T_TEST_POINT_SMALL]
TP1113  TEST_POINT_T_SMALL  [T_TEST_POINT_SMALL]
TP1114  TEST_POINT_T_SMALL  [T_TEST_POINT_SMALL]
TP1115  TEST_POINT_T_SMALL  [T_TEST_POINT_SMALL]
TP1116  TEST_POINT_T_SMALL  [T_TEST_POINT_SMALL]
TP1117  TEST_POINT_T_SMALL  [T_TEST_POINT_SMALL]
TP1118  TEST_POINT_T_SMALL  [T_TEST_POINT_SMALL]
TP1119  TEST_POINT_T_SMALL  [T_TEST_POINT_SMALL]
TP1120  TEST_POINT_T_SMALL  [T_TEST_POINT_SMALL]
TP1121  TEST_POINT_T_SMALL  [T_TEST_POINT_SMALL]
TP1122  TEST_POINT_T_SMALL  [T_TEST_POINT_SMALL]
TP1123  TEST_POINT_T_SMALL  [T_TEST_POINT_SMALL]
TP1124  TEST_POINT_T_SMALL  [T_TEST_POINT_SMALL]
TP1125  TEST_POINT_T_SMALL  [T_TEST_POINT_SMALL]
TP1126  TEST_POINT_T_SMALL  [T_TEST_POINT_SMALL]
TP1127  TEST_POINT_T_SMALL  [T_TEST_POINT_SMALL]

### Nets
GND [pwr]: H1101.H1(MOUNT) H1102.H1(MOUNT) H1103.H1(MOUNT) H1104.H1(MOUNT) ; also sheet 1,2,3,4,5,6,7,8,9,10,12,13,14,15,16
Unconnected: FD1101.1(NC) FD1102.1(NC) TP1101.1(TP) TP1102.1(TP) TP1103.1(TP) TP1104.1(TP) TP1105.1(TP) TP1106.1(TP) TP1107.1(TP) TP1108.1(TP) TP1109.1(TP) TP1110.1(TP) TP1111.1(TP) TP1112.1(TP) TP1113.1(TP) TP1114.1(TP) TP1115.1(TP) TP1116.1(TP) TP1117.1(TP) TP1118.1(TP) TP1119.1(TP) TP1120.1(TP) TP1121.1(TP) TP1122.1(TP) TP1123.1(TP) TP1124.1(TP) TP1125.1(TP) TP1126.1(TP) TP1127.1(TP)

## Sheet 12 of 16
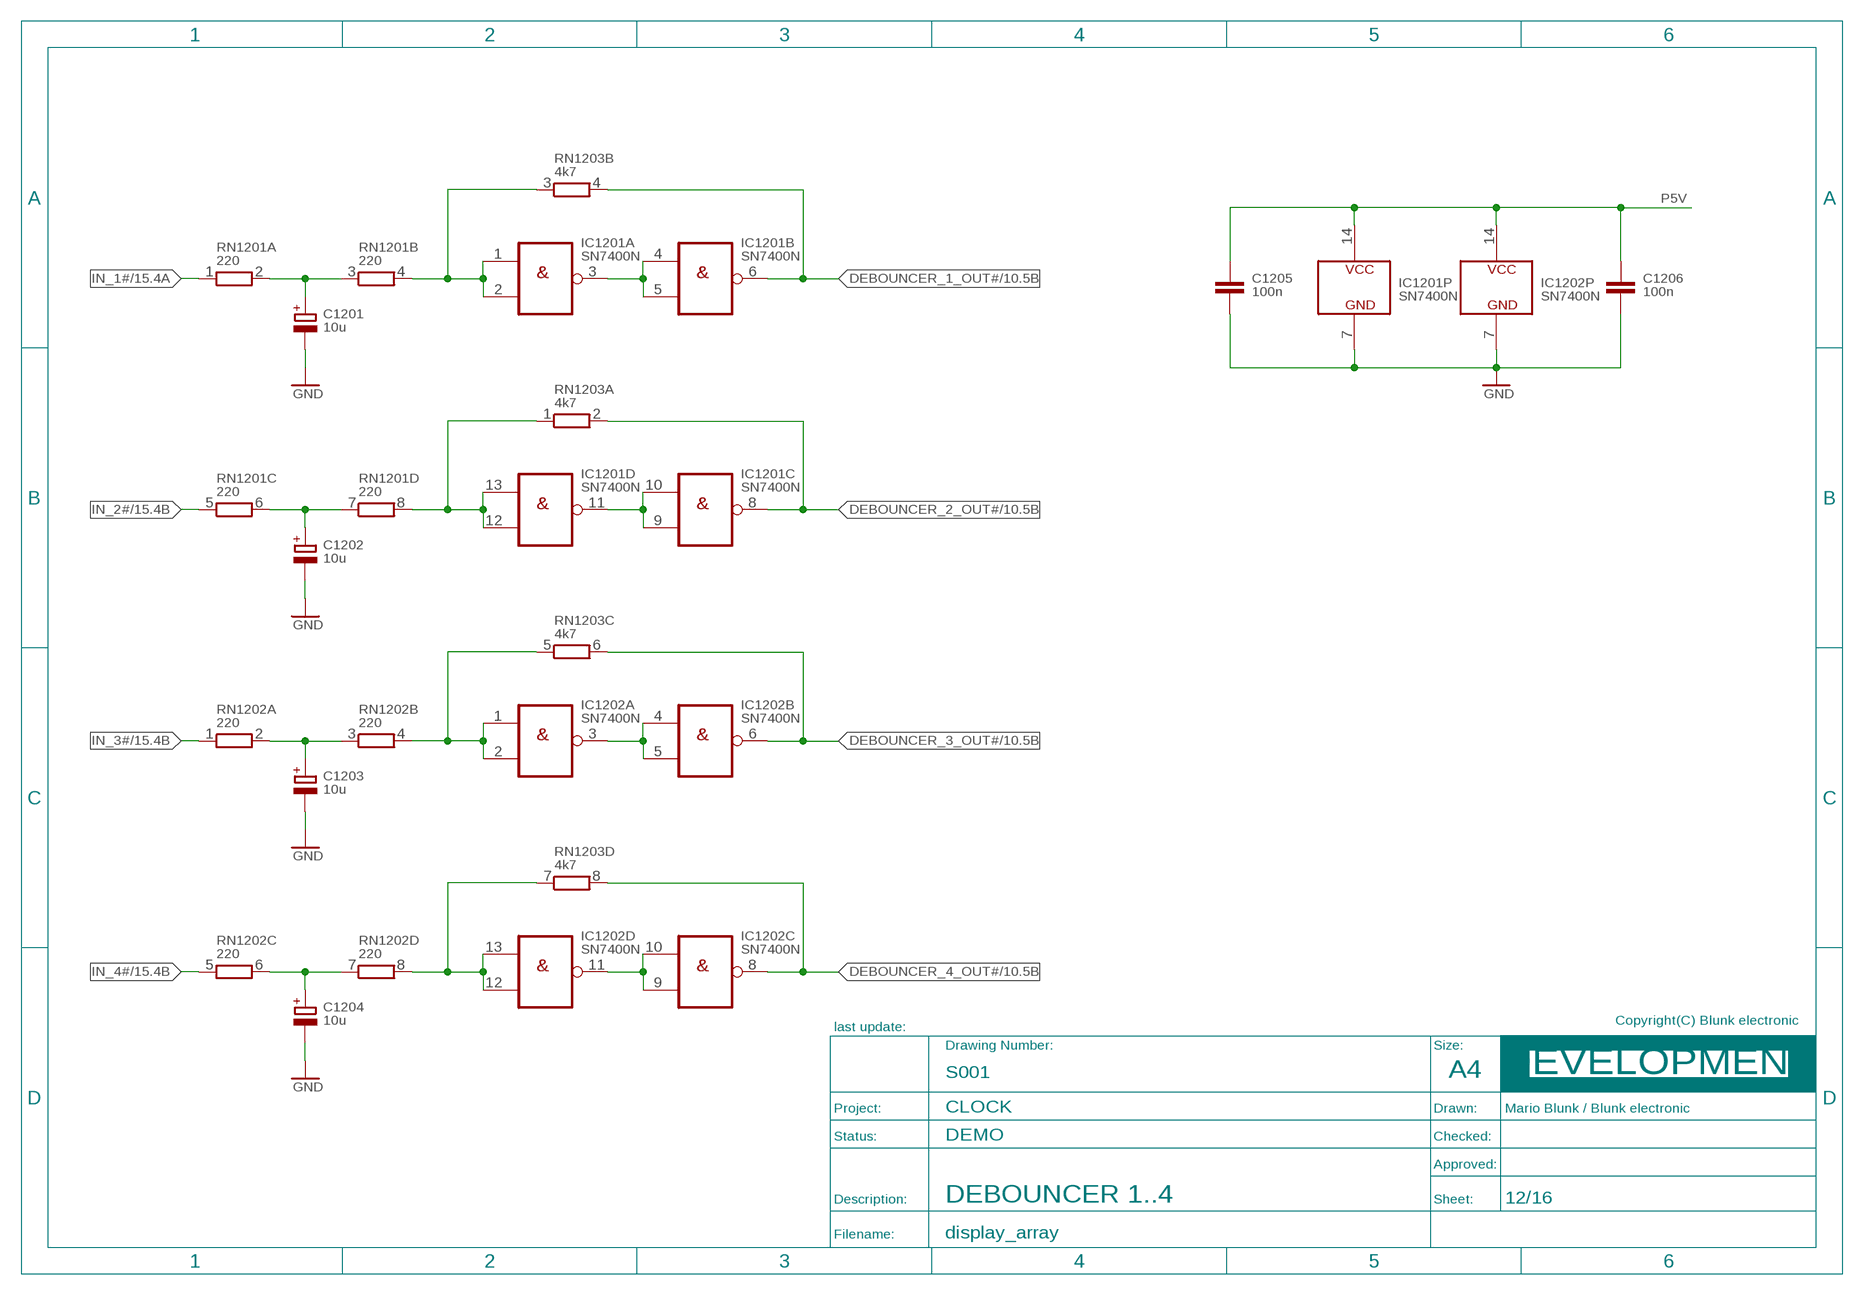
[diagram p11: schematic, sheet 12]
FRAME_DEVELOPMENT4 (A4_LANDSCAPE_DEVELOPMENT): BOM: NO; COMMISSIONED: 2013-08-30; DESCRIPTION: DEBOUNCER 1..4

### Parts
C1201  10u  C_POL_EU_T_RAD5_GRID_2.54  [T_RADIAL_5MM_GRID_2.54MM]
C1202  10u  C_POL_EU_T_RAD5_GRID_2.54  [T_RADIAL_5MM_GRID_2.54MM]
C1203  10u  C_POL_EU_T_RAD5_GRID_2.54  [T_RADIAL_5MM_GRID_2.54MM]
C1204  10u  C_POL_EU_T_RAD5_GRID_2.54  [T_RADIAL_5MM_GRID_2.54MM]
C1205  100n  C_EU_S_0805  [S_0805]
C1206  100n  C_EU_S_0805  [S_0805]
IC1201  SN7400N  7400N  [T_NDIP14]
IC1202  SN7400N  7400N  [T_NDIP14]
RN1201  220  R_EU_ARRAY_4  [T_SIL8]
RN1202  220  R_EU_ARRAY_4  [T_SIL8]
RN1203  4k7  R_EU_ARRAY_4  [T_SIL8]

### Nets
DEBOUNCER_1_OUT#: IC1201.6(B:O) RN1203.4 ; also sheet 10
DEBOUNCER_2_OUT#: IC1201.8(C:O) RN1203.2 ; also sheet 10
DEBOUNCER_3_OUT#: IC1202.6(B:O) RN1203.6 ; also sheet 10
DEBOUNCER_4_OUT#: IC1202.8(C:O) RN1203.8 ; also sheet 10
DEBOUNCER_10: C1201.+ RN1201.2 RN1201.3
DEBOUNCER_11: IC1201.1(A:I0) IC1201.2(A:I1) RN1201.4 RN1203.3
DEBOUNCER_12: IC1201.3(A:O) IC1201.4(B:I0) IC1201.5(B:I1)
DEBOUNCER_20: C1202.+ RN1201.6 RN1201.7
DEBOUNCER_21: IC1201.12(D:I1) IC1201.13(D:I0) RN1201.8 RN1203.1
DEBOUNCER_22: IC1201.9(C:I1) IC1201.10(C:I0) IC1201.11(D:O)
DEBOUNCER_30: C1203.+ RN1202.2 RN1202.3
DEBOUNCER_31: IC1202.1(A:I0) IC1202.2(A:I1) RN1202.4 RN1203.5
DEBOUNCER_32: IC1202.3(A:O) IC1202.4(B:I0) IC1202.5(B:I1)
DEBOUNCER_40: C1204.+ RN1202.6 RN1202.7
DEBOUNCER_41: IC1202.12(D:I1) IC1202.13(D:I0) RN1202.8 RN1203.7
DEBOUNCER_42: IC1202.9(C:I1) IC1202.10(C:I0) IC1202.11(D:O)
GND [pwr]: C1201.- C1202.- C1203.- C1204.- C1205.2 C1206.2 IC1201.7(P:GND) IC1202.7(P:GND) ; also sheet 1,2,3,4,5,6,7,8,9,10,11,13,14,15,16
IN_1#: RN1201.1 ; also sheet 15
IN_2#: RN1201.5 ; also sheet 15
IN_3#: RN1202.1 ; also sheet 15
IN_4#: RN1202.5 ; also sheet 15
P5V [pwr]: C1205.1 C1206.1 IC1201.14(P:VCC) IC1202.14(P:VCC) ; also sheet 1,2,3,4,5,6,7,8,9,10,13,14,16

## Sheet 13 of 16
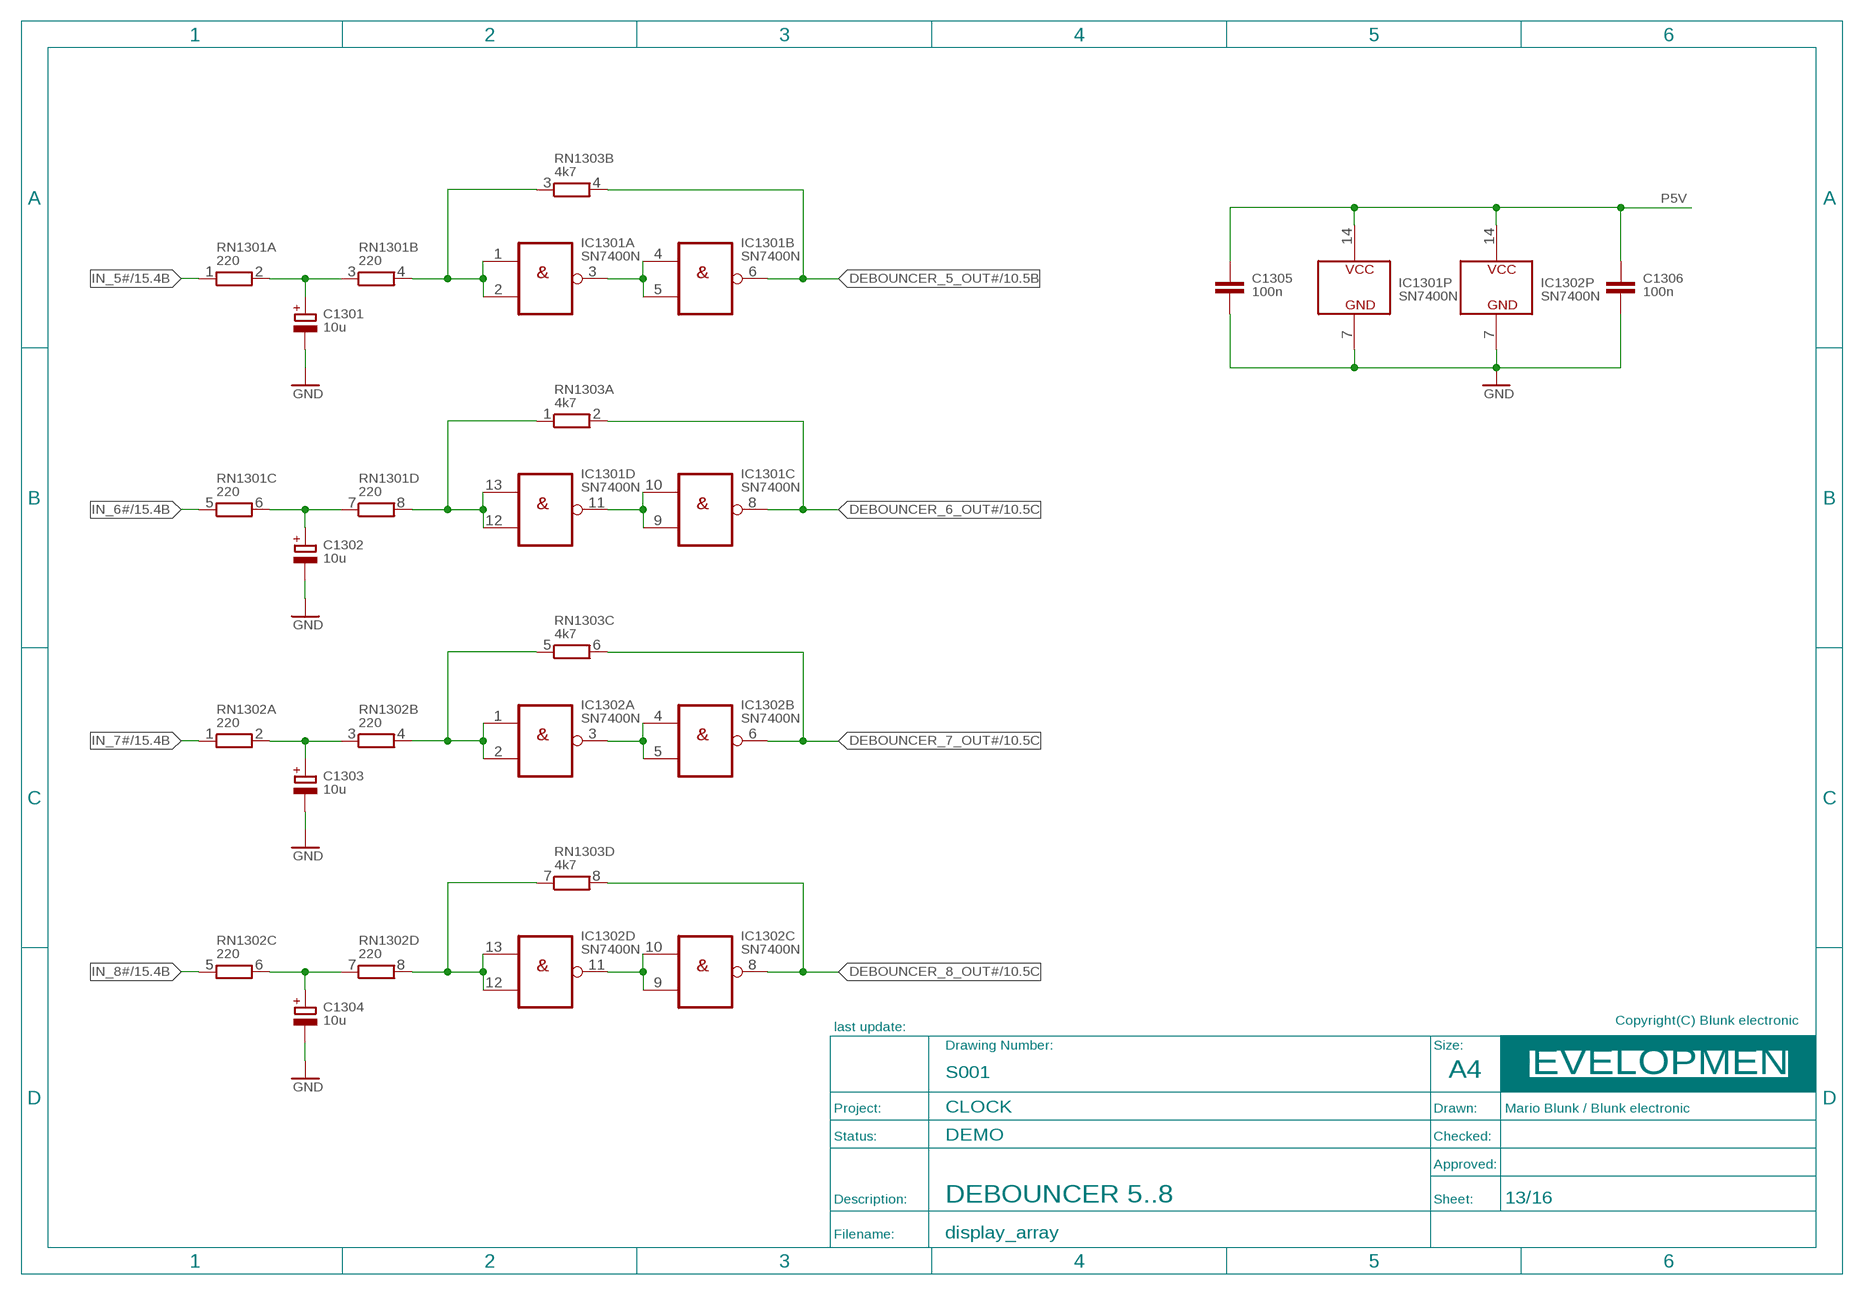
[diagram p12: schematic, sheet 13]
FRAME_DEVELOPMENT5 (A4_LANDSCAPE_DEVELOPMENT): BOM: NO; COMMISSIONED: 2013-08-30; DESCRIPTION: DEBOUNCER 5..8

### Parts
C1301  10u  C_POL_EU_T_RAD5_GRID_2.54  [T_RADIAL_5MM_GRID_2.54MM]
C1302  10u  C_POL_EU_T_RAD5_GRID_2.54  [T_RADIAL_5MM_GRID_2.54MM]
C1303  10u  C_POL_EU_T_RAD5_GRID_2.54  [T_RADIAL_5MM_GRID_2.54MM]
C1304  10u  C_POL_EU_T_RAD5_GRID_2.54  [T_RADIAL_5MM_GRID_2.54MM]
C1305  100n  C_EU_S_0805  [S_0805]
C1306  100n  C_EU_S_0805  [S_0805]
IC1301  SN7400N  7400N  [T_NDIP14]
IC1302  SN7400N  7400N  [T_NDIP14]
RN1301  220  R_EU_ARRAY_4  [T_SIL8]
RN1302  220  R_EU_ARRAY_4  [T_SIL8]
RN1303  4k7  R_EU_ARRAY_4  [T_SIL8]

### Nets
DEBOUNCER_5_OUT#: IC1301.6(B:O) RN1303.4 ; also sheet 10
DEBOUNCER_6_OUT#: IC1301.8(C:O) RN1303.2 ; also sheet 10
DEBOUNCER_7_OUT#: IC1302.6(B:O) RN1303.6 ; also sheet 10
DEBOUNCER_8_OUT#: IC1302.8(C:O) RN1303.8 ; also sheet 10
DEBOUNCER_50: C1301.+ RN1301.2 RN1301.3
DEBOUNCER_51: IC1301.1(A:I0) IC1301.2(A:I1) RN1301.4 RN1303.3
DEBOUNCER_52: IC1301.3(A:O) IC1301.4(B:I0) IC1301.5(B:I1)
DEBOUNCER_60: C1302.+ RN1301.6 RN1301.7
DEBOUNCER_61: IC1301.12(D:I1) IC1301.13(D:I0) RN1301.8 RN1303.1
DEBOUNCER_62: IC1301.9(C:I1) IC1301.10(C:I0) IC1301.11(D:O)
DEBOUNCER_70: C1303.+ RN1302.2 RN1302.3
DEBOUNCER_71: IC1302.1(A:I0) IC1302.2(A:I1) RN1302.4 RN1303.5
DEBOUNCER_72: IC1302.3(A:O) IC1302.4(B:I0) IC1302.5(B:I1)
DEBOUNCER_80: C1304.+ RN1302.6 RN1302.7
DEBOUNCER_81: IC1302.12(D:I1) IC1302.13(D:I0) RN1302.8 RN1303.7
DEBOUNCER_82: IC1302.9(C:I1) IC1302.10(C:I0) IC1302.11(D:O)
GND [pwr]: C1301.- C1302.- C1303.- C1304.- C1305.2 C1306.2 IC1301.7(P:GND) IC1302.7(P:GND) ; also sheet 1,2,3,4,5,6,7,8,9,10,11,12,14,15,16
IN_5#: RN1301.1 ; also sheet 15
IN_6#: RN1301.5 ; also sheet 15
IN_7#: RN1302.1 ; also sheet 15
IN_8#: RN1302.5 ; also sheet 15
P5V [pwr]: C1305.1 C1306.1 IC1301.14(P:VCC) IC1302.14(P:VCC) ; also sheet 1,2,3,4,5,6,7,8,9,10,12,14,16

## Sheet 14 of 16
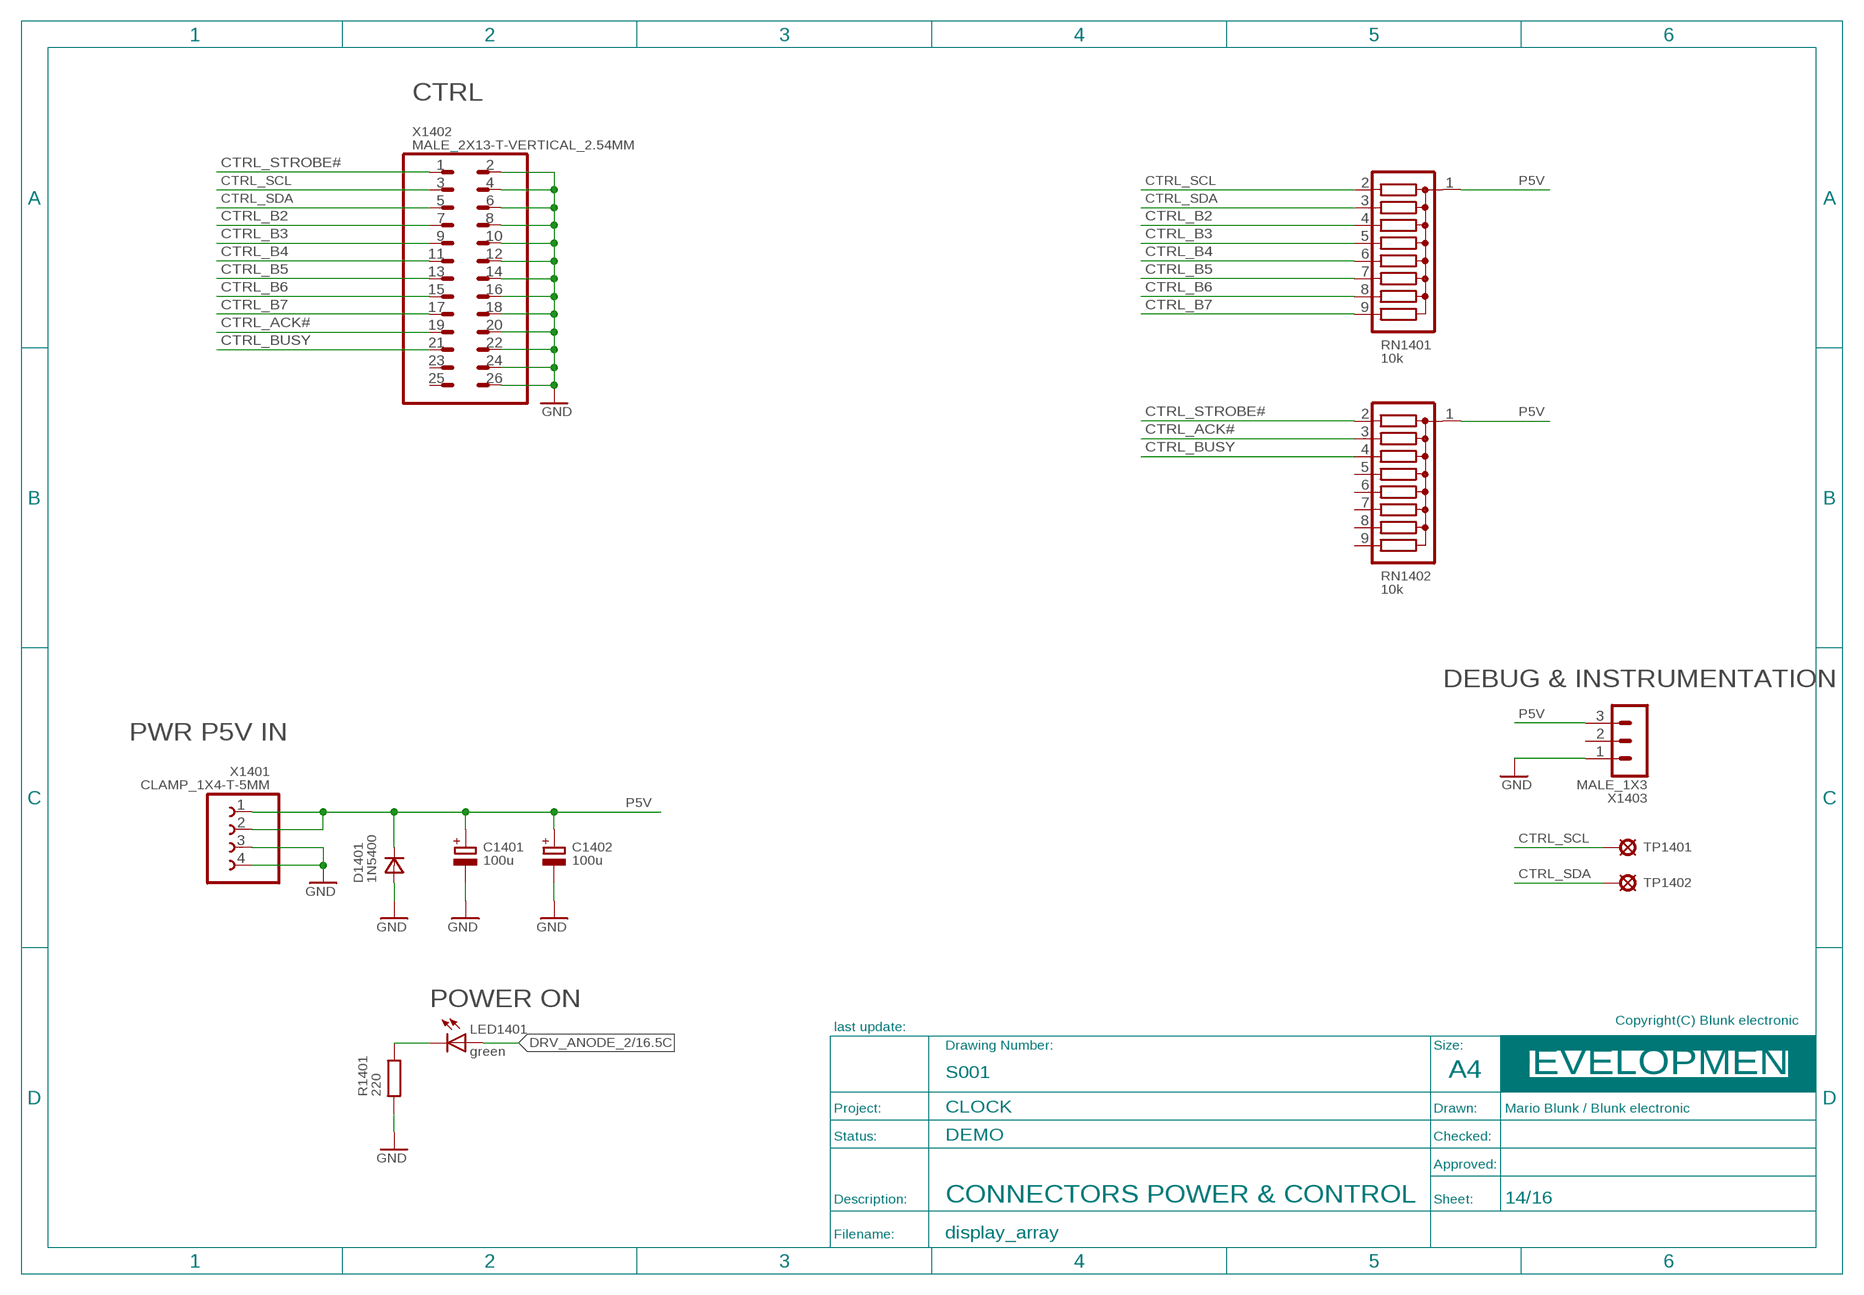
[diagram p13: schematic, sheet 14]
FRAME_DEVELOPMENT6 (A4_LANDSCAPE_DEVELOPMENT): BOM: NO; COMMISSIONED: 2013-08-30; DESCRIPTION: CONNECTORS POWER & CONTROL

### Parts
C1401  100u  C_POL_EU_T_RAD7_GRID_2.54  [T_RADIAL_7MM_GRID_2.54MM]
C1402  100u  C_POL_EU_T_RAD7_GRID_2.54  [T_RADIAL_7MM_GRID_2.54MM]
D1401  1N5400  SINGLE_T_DO201_GRID_18MM  [T_DO201_GRID_18MM]
LED1401  green  LED_S_0805  [S_0805]
R1401  220  R_EU_S_0805  [S_0805]
RN1401  10k  R_EU_ARRAY_1C_8_T_SIL9  [T_SIL9]
RN1402  10k  R_EU_ARRAY_1C_8_T_SIL9  [T_SIL9]
TP1401  TEST_POINT_T_SMALL  [T_TEST_POINT_SMALL]
TP1402  TEST_POINT_T_SMALL  [T_TEST_POINT_SMALL]
X1401  CLAMP_1X4-T-5MM  [T_WIRE_CLAMP_1X4_5MM]
X1402  MALE_2X13-T-VERTICAL_2.54MM  [T_MALE_2X13_VERTICAL_GRID_2.54MM]
X1403  MALE_1X3  [T_MALE_3X1_VERTICAL]

### Nets
CTRL_ACK#: RN1402.3 X1402.19
CTRL_B2: RN1401.4 X1402.7
CTRL_B3: RN1401.5 X1402.9
CTRL_B4: RN1401.6 X1402.11
CTRL_B5: RN1401.7 X1402.13
CTRL_B6: RN1401.8 X1402.15
CTRL_B7: RN1401.9 X1402.17
CTRL_BUSY: RN1402.4 X1402.21
CTRL_SCL: RN1401.2 TP1401.1(TP) X1402.3 ; also sheet 1,2,3,4,5,6,7,8,9,10
CTRL_SDA: RN1401.3 TP1402.1(TP) X1402.5 ; also sheet 1,2,3,4,5,6,7,8,9,10
CTRL_STROBE#: RN1402.2 X1402.1
DRV_ANODE_2 [pwr]: LED1401.A ; also sheet 5,6,7,8,16
GND [pwr]: C1401.- C1402.- D1401.A R1401.1 X1401.3 X1401.4 X1402.2 X1402.4 X1402.6 X1402.8 X1402.10 X1402.12 X1402.14 X1402.16 X1402.18 X1402.20 X1402.22 X1402.24 X1402.26 X1403.1 ; also sheet 1,2,3,4,5,6,7,8,9,10,11,12,13,15,16
P5V [pwr]: C1401.+ C1402.+ D1401.C RN1401.1 RN1402.1 X1401.1 X1401.2 X1403.3 ; also sheet 1,2,3,4,5,6,7,8,9,10,12,13,16
P5V_LED: LED1401.C R1401.2
Unconnected: RN1402.5 RN1402.6 RN1402.7 RN1402.8 RN1402.9 X1402.23 X1402.25 X1403.2

## Sheet 15 of 16
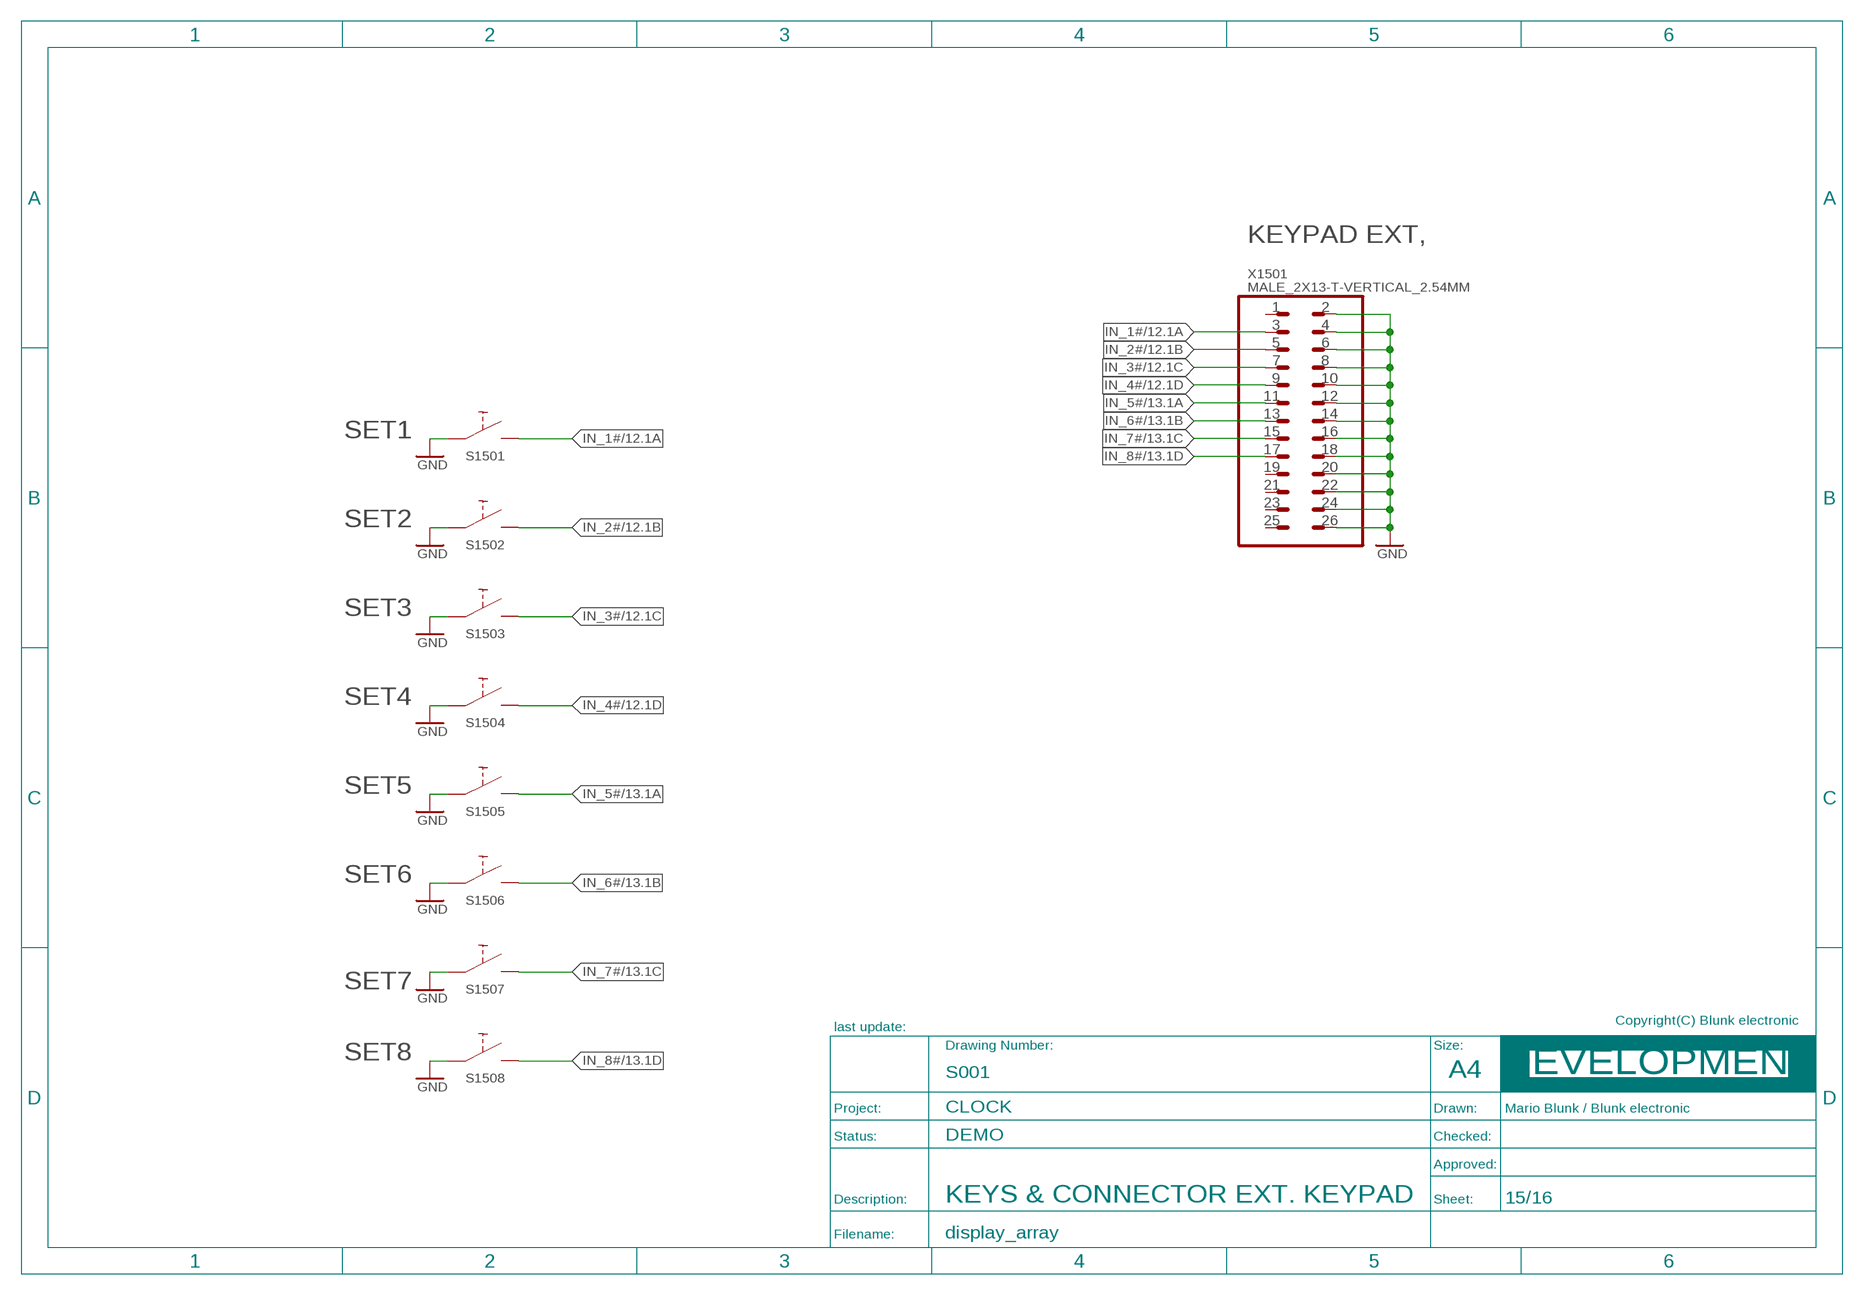
[diagram p14: schematic, sheet 15]
FRAME_DEVELOPMENT7 (A4_LANDSCAPE_DEVELOPMENT): BOM: NO; COMMISSIONED: 2013-08-30; DESCRIPTION: KEYS & CONNECTOR EXT. KEYPAD

### Parts
S1501  set  PUSH_BUTTON_T_6X6MM  [T_PUSH_BUTTON_6X6]
S1502  set  PUSH_BUTTON_T_6X6MM  [T_PUSH_BUTTON_6X6]
S1503  set  PUSH_BUTTON_T_6X6MM  [T_PUSH_BUTTON_6X6]
S1504  set  PUSH_BUTTON_T_6X6MM  [T_PUSH_BUTTON_6X6]
S1505  set  PUSH_BUTTON_T_6X6MM  [T_PUSH_BUTTON_6X6]
S1506  set  PUSH_BUTTON_T_6X6MM  [T_PUSH_BUTTON_6X6]
S1507  set  PUSH_BUTTON_T_6X6MM  [T_PUSH_BUTTON_6X6]
S1508  set  PUSH_BUTTON_T_6X6MM  [T_PUSH_BUTTON_6X6]
X1501  MALE_2X13-T-VERTICAL_2.54MM  [T_MALE_2X13_VERTICAL_GRID_2.54MM]

### Nets
GND [pwr]: S1501.1(A1) S1501.3(A1) S1502.1(A1) S1502.3(A1) S1503.1(A1) S1503.3(A1) S1504.1(A1) S1504.3(A1) S1505.1(A1) S1505.3(A1) S1506.1(A1) S1506.3(A1) S1507.1(A1) S1507.3(A1) S1508.1(A1) S1508.3(A1) X1501.2 X1501.4 X1501.6 X1501.8 X1501.10 X1501.12 X1501.14 X1501.16 X1501.18 X1501.20 X1501.22 X1501.24 X1501.26 ; also sheet 1,2,3,4,5,6,7,8,9,10,11,12,13,14,16
IN_1#: S1501.2(B1) S1501.4(B1) X1501.3 ; also sheet 12
IN_2#: S1502.2(B1) S1502.4(B1) X1501.5 ; also sheet 12
IN_3#: S1503.2(B1) S1503.4(B1) X1501.7 ; also sheet 12
IN_4#: S1504.2(B1) S1504.4(B1) X1501.9 ; also sheet 12
IN_5#: S1505.2(B1) S1505.4(B1) X1501.11 ; also sheet 13
IN_6#: S1506.2(B1) S1506.4(B1) X1501.13 ; also sheet 13
IN_7#: S1507.2(B1) S1507.4(B1) X1501.15 ; also sheet 13
IN_8#: S1508.2(B1) S1508.4(B1) X1501.17 ; also sheet 13
Unconnected: X1501.1 X1501.19 X1501.21 X1501.23 X1501.25

## Sheet 16 of 16
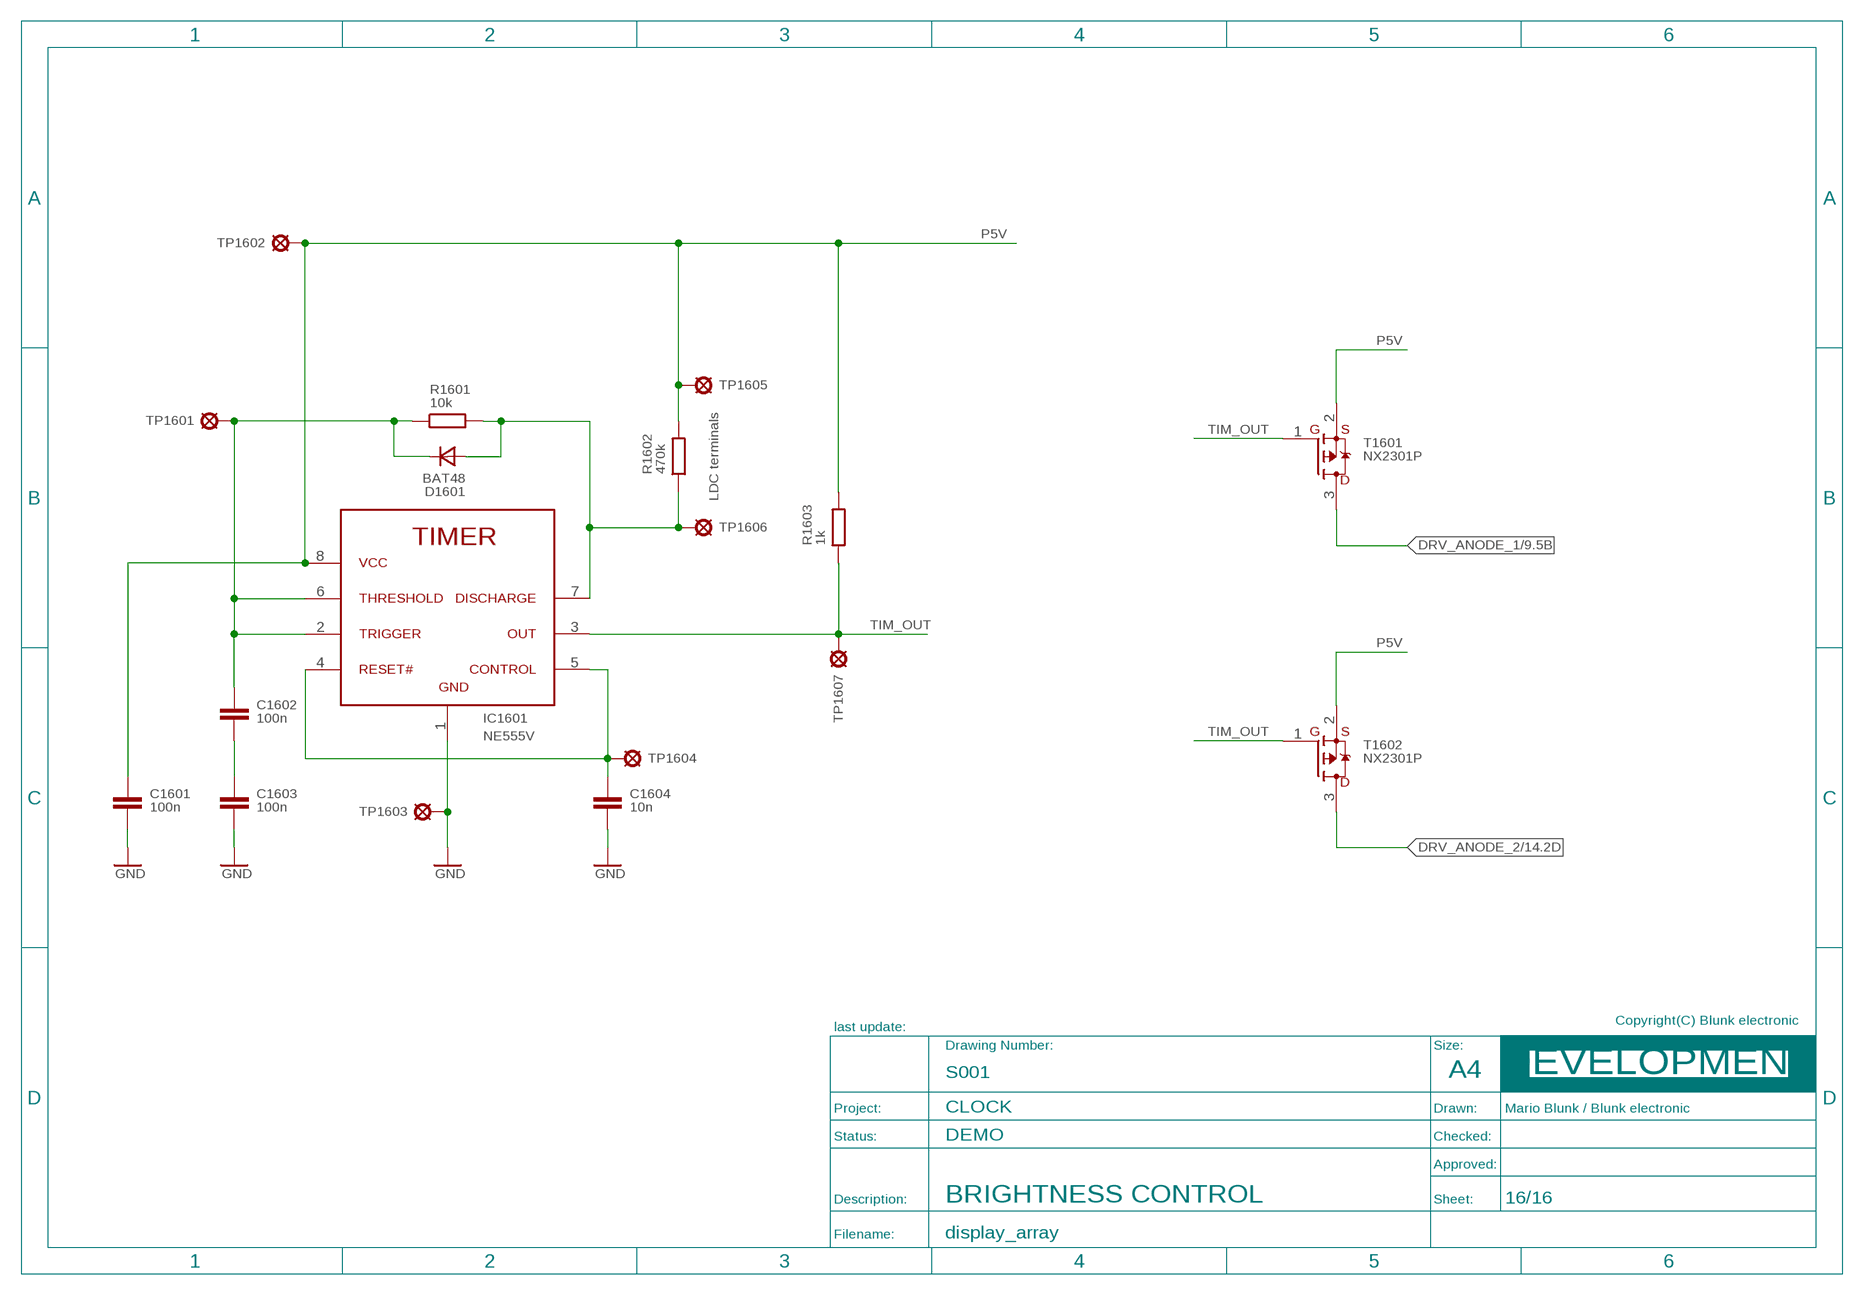
[diagram p15: schematic, sheet 16]
FRAME_DEVELOPMENT8 (A4_LANDSCAPE_DEVELOPMENT): BOM: NO; COMMISSIONED: 2013-08-30; DESCRIPTION: BRIGHTNESS CONTROL

### Parts
C1601  100n  C_EU_S_0805  [S_0805]
C1602  100n  C_EU_S_0805  [S_0805]
C1603  100n  C_EU_S_0805  [S_0805]
C1604  10n  C_EU_S_0805  [S_0805]
D1601  BAT48  SINGLE_T_DO204_GRID_10MM  [T_DO204_GRID_10MM]
IC1601  NE555V  555P  [T_NDIP8]
R1601  10k  R_EU_S_0805  [S_0805]
R1602  470k  R_EU_S_0805  [S_0805]
R1603  1k  R_EU_S_0805  [S_0805]
T1601  NX2301P  P-MOSFET  [S_SOT23]
T1602  NX2301P  P-MOSFET  [S_SOT23]
TP1601  TEST_POINT_T_SMALL  [T_TEST_POINT_SMALL]
TP1602  TEST_POINT_T_SMALL  [T_TEST_POINT_SMALL]
TP1603  TEST_POINT_T_SMALL  [T_TEST_POINT_SMALL]
TP1604  TEST_POINT_T_SMALL  [T_TEST_POINT_SMALL]
TP1605  TEST_POINT_T_LARGE  [T_TEST_POINT_LARGE]
TP1606  TEST_POINT_T_LARGE  [T_TEST_POINT_LARGE]
TP1607  TEST_POINT_T_SMALL  [T_TEST_POINT_SMALL]

### Nets
DRV_ANODE_1 [pwr]: T1601.3(D) ; also sheet 1,2,3,4,9
DRV_ANODE_2 [pwr]: T1602.3(D) ; also sheet 5,6,7,8,14
GND [pwr]: C1601.2 C1603.2 C1604.2 IC1601.1(GND) TP1603.1(TP) ; also sheet 1,2,3,4,5,6,7,8,9,10,11,12,13,14,15
P5V [pwr]: C1601.1 IC1601.8(VCC) R1602.2 R1603.2 T1601.2(S) T1602.2(S) TP1602.1(TP) TP1605.1(TP) ; also sheet 1,2,3,4,5,6,7,8,9,10,12,13,14
TIM_1: C1604.1 IC1601.4(RST#) IC1601.5(OC) TP1604.1(TP)
TIM_2: C1602.1 D1601.C IC1601.2(TRG) IC1601.6(TRSHLD) R1601.1 TP1601.1(TP)
TIM_3: D1601.A IC1601.7(DSCHRG) R1601.2 R1602.1 TP1606.1(TP)
TIM_45: C1602.2 C1603.1
TIM_OUT: IC1601.3(OUT) R1603.1 T1601.1(G) T1602.1(G) TP1607.1(TP)

### Notes on the sheet
- LDC terminals

## Library data of the parts
C101 C201 C301 C401 C501 C601 C701 C801 C901 C1001 C1205 C1206 C1305 C1306 C1601-C1603 = be_rcl:C_EU: drawn: Mario Blunk / Blunk electronic; BOM: YES; COMMISSIONED: 2013-08-30; PART_CODE_BEL: C_PAC_S_0805_VAL_100n
C1201-C1204 C1301-C1304 = be_rcl:C_POL_EU: drawn: Mario Blunk / Blunk electronic; BOM: YES; COMMISSIONED: 2015-01-15; PART_CODE_BEL: C_PAC_T_RADIAL_5mm_GRID_2.54mm_VAL_10u_Vmax_35V
C1401 C1402 = be_rcl:C_POL_EU: drawn: Mario Blunk / Blunk electronic; BOM: YES; COMMISSIONED: 2014-10-13; PART_CODE_BEL: C_PAC_T_RADIAL_7mm_GRID_2.54mm_VAL_100u_Vmax_35V
C1604 = be_rcl:C_EU: drawn: Mario Blunk / Blunk electronic; BOM: YES; COMMISSIONED: 2013-08-30; PART_CODE_BEL: C_PAC_S_0805_VAL_10n
D1401 = be_diode:SINGLE: edited: Mario Blunk / Blunk electronic; BOM: YES; COMMISSIONED: 2015-10-16; PART_CODE_BEL: D_PAC_T_DO201_GRID_18MM_VAL_1N5400
D1601 = be_diode:SINGLE: edited: Mario Blunk / Blunk electronic; BOM: YES; COMMISSIONED: 2014-09-03; PART_CODE_BEL: D_PAC_T_DO204_GRID_10mm_VAL_BAT48; UPDATED: 2015-04-14
DIS101 = be_opt:VQB71: edited: Mario Blunk / Blunk electronic; BOM: YES; COMMISSIONED: 2015-10-02; FUNCTION: digit 10^0; PART_CODE_BEL: DIS_PAC_T_VQB71_VAL_VQB71
DIS201 = be_opt:VQB71: edited: Mario Blunk / Blunk electronic; BOM: YES; COMMISSIONED: 2015-10-02; FUNCTION: digit 10^1; PART_CODE_BEL: DIS_PAC_T_VQB71_VAL_VQB71
DIS301 = be_opt:VQB71: edited: Mario Blunk / Blunk electronic; BOM: YES; COMMISSIONED: 2015-10-02; FUNCTION: digit 10^2; PART_CODE_BEL: DIS_PAC_T_VQB71_VAL_VQB71
DIS401 = be_opt:VQB71: edited: Mario Blunk / Blunk electronic; BOM: YES; COMMISSIONED: 2015-10-02; FUNCTION: digit 10^3; PART_CODE_BEL: DIS_PAC_T_VQB71_VAL_VQB71
DIS501 = be_opt:VQB71: edited: Mario Blunk / Blunk electronic; BOM: YES; COMMISSIONED: 2015-10-02; FUNCTION: digit 10^4; PART_CODE_BEL: DIS_PAC_T_VQB71_VAL_VQB71
DIS601 = be_opt:VQB71: edited: Mario Blunk / Blunk electronic; BOM: YES; COMMISSIONED: 2015-10-02; FUNCTION: digit 10^5; PART_CODE_BEL: DIS_PAC_T_VQB71_VAL_VQB71
DIS701 = be_opt:VQB71: edited: Mario Blunk / Blunk electronic; BOM: YES; COMMISSIONED: 2015-10-02; FUNCTION: digit 10^6; PART_CODE_BEL: DIS_PAC_T_VQB71_VAL_VQB71
DIS801 = be_opt:VQB71: edited: Mario Blunk / Blunk electronic; BOM: YES; COMMISSIONED: 2015-10-02; FUNCTION: digit 10^7; PART_CODE_BEL: DIS_PAC_T_VQB71_VAL_VQB71
FD1101 FD1102 = be_marks:FIDUCIAL: drawn: Mario Blunk / Blunk electronic; BOM: NO; COMMISSIONED: 2013-12-03
H1101-H1104 = be_holes:HOLE: edited: Mario Blunk; BOM: NO; COMMISSIONED: 2014-10-13
IC101 IC201 IC301 IC401 IC501 IC601 IC701 IC801 = be_i2c:PCF8574: edited: Mario Blunk / Blunk electronic; BOM: YES; COMMISSIONED: 2015-10-14; PART_CODE_BEL: IC_PAC_S_SOIC16_VAL_PCF8574T
IC901 IC1001 = be_i2c:PCF8574: edited: Mario Blunk / Blunk electronic; BOM: YES; COMMISSIONED: 2015-10-14; PART_CODE_BEL: IC_PAC_S_SOIC16_VAL_PCF8574AT
IC1201 IC1202 IC1301 IC1302 = be_logic:7400: edited: Mario Blunk / Blunk electronic; BOM: YES; COMMISSIONED: 2015-10-14; PART_CODE_BEL: IC_PAC_T_NDIP14_VAL_SN7400N
IC1601 = be_timer:555: edited: Mario Blunk / Blunk electronic; BOM: YES; COMMISSIONED: 2015-10-15; PART_CODE_BEL: IC_PAC_T_NDIP8_VAL_NE555V
LED901-LED903 LED911-LED913 = be_opt:LED: single LED device drawn: Mario Blunk / Blunk electronic; BOM: YES; COMMISSIONED: 2013-08-30; FUNCTION: blinking dot; PART_CODE_BEL: LED_PAC_S_0805_VAL_red
LED904 = be_opt:LED: single LED device drawn: Mario Blunk / Blunk electronic; BOM: YES; COMMISSIONED: 2013-08-30; FUNCTION: status #1; PART_CODE_BEL: LED_PAC_S_0805_VAL_green
LED905 = be_opt:LED: single LED device drawn: Mario Blunk / Blunk electronic; BOM: YES; COMMISSIONED: 2013-08-30; FUNCTION: status #2; PART_CODE_BEL: LED_PAC_S_0805_VAL_green
LED906 = be_opt:LED: single LED device drawn: Mario Blunk / Blunk electronic; BOM: YES; COMMISSIONED: 2013-08-30; FUNCTION: status #3; PART_CODE_BEL: LED_PAC_S_0805_VAL_yellow
LED907 = be_opt:LED: single LED device drawn: Mario Blunk / Blunk electronic; BOM: YES; COMMISSIONED: 2013-08-30; FUNCTION: status #4; PART_CODE_BEL: LED_PAC_S_0805_VAL_yellow
LED908 = be_opt:LED: single LED device drawn: Mario Blunk / Blunk electronic; BOM: YES; COMMISSIONED: 2013-08-30; FUNCTION: status #5; PART_CODE_BEL: LED_PAC_S_0805_VAL_red
LED909 = be_opt:LED: single LED device drawn: Mario Blunk / Blunk electronic; BOM: YES; COMMISSIONED: 2013-08-30; FUNCTION: status #6; PART_CODE_BEL: LED_PAC_S_0805_VAL_blue
LED910 = be_opt:LED: single LED device drawn: Mario Blunk / Blunk electronic; BOM: YES; COMMISSIONED: 2013-08-30; FUNCTION: status #7; PART_CODE_BEL: LED_PAC_S_0805_VAL_blue
LED1401 = be_opt:LED: single LED device drawn: Mario Blunk / Blunk electronic; BOM: YES; COMMISSIONED: 2013-08-30; FUNCTION: POWER ON; PART_CODE_BEL: LED_PAC_S_0805_VAL_green
R901-R903 = be_rcl:R_EU: Resistor Device EU drawn: Mario Blunk / Blunk electronic; BOM: YES; COMMISSIONED: 2013-08-30; PART_CODE_BEL: R_PAC_S_0805_VAL_1k5
R904 R905 = be_rcl:R_EU: Resistor Device EU drawn: Mario Blunk / Blunk electronic; BOM: YES; COMMISSIONED: 2013-08-30; PART_CODE_BEL: R_PAC_S_0805_VAL_750
R906 R907 = be_rcl:R_EU: Resistor Device EU drawn: Mario Blunk / Blunk electronic; BOM: YES; COMMISSIONED: 2013-08-30; PART_CODE_BEL: R_PAC_S_0805_VAL_2k2
R908 = be_rcl:R_EU: Resistor Device EU drawn: Mario Blunk / Blunk electronic; BOM: YES; COMMISSIONED: 2013-08-30; PART_CODE_BEL: R_PAC_S_0805_VAL_3k3
R909 R910 = be_rcl:R_EU: Resistor Device EU drawn: Mario Blunk / Blunk electronic; BOM: YES; COMMISSIONED: 2013-08-30; PART_CODE_BEL: R_PAC_S_0805_VAL_2k4
R1401 = be_rcl:R_EU: Resistor Device EU drawn: Mario Blunk / Blunk electronic; BOM: YES; COMMISSIONED: 2013-08-30; PART_CODE_BEL: R_PAC_S_0805_VAL_220
R1601 = be_rcl:R_EU: Resistor Device EU drawn: Mario Blunk / Blunk electronic; BOM: YES; COMMISSIONED: 2013-08-30; PART_CODE_BEL: R_PAC_S_0805_VAL_10k
R1602 = be_rcl:R_EU: Resistor Device EU drawn: Mario Blunk / Blunk electronic; BOM: YES; COMMISSIONED: 2013-08-30; PART_CODE_BEL: R_PAC_S_0805_VAL_470k
R1603 = be_rcl:R_EU: Resistor Device EU drawn: Mario Blunk / Blunk electronic; BOM: YES; COMMISSIONED: 2013-08-30; PART_CODE_BEL: R_PAC_S_0805_VAL_1k
RN101 RN102 RN201 RN202 RN301 RN302 RN401 RN402 RN501 RN502 RN601 RN602 RN701 RN702 RN801 RN802 RN1001 RN1002 = be_rcl:R_EU_ARRAY_4: edited: Mario Blunk / Blunk electronic; BOM: YES; COMMISSIONED: 2014-10-14; PART_CODE_BEL: RN_PAC_T_SIL8_VAL_100; UPDATED: 2015-10-14
RN1201 RN1202 RN1301 RN1302 = be_rcl:R_EU_ARRAY_4: edited: Mario Blunk / Blunk electronic; BOM: YES; COMMISSIONED: 2014-10-14; PART_CODE_BEL: RN_PAC_T_SIL8_VAL_220; UPDATED: 2015-10-14
RN1203 RN1303 = be_rcl:R_EU_ARRAY_4: edited: Mario Blunk / Blunk electronic; BOM: YES; COMMISSIONED: 2014-10-14; PART_CODE_BEL: RN_PAC_T_SIL8_VAL_4k7; UPDATED: 2015-10-14
RN1401 RN1402 = be_rcl:R_EU_ARRAY_1C_8: edited: Mario Blunk; BOM: NO; COMMISSIONED: 2014-10-14; PART_CODE_BEL: RN_PAC_T_SIL9_VAL_
S1501 = be_switch:PUSH_BUTTON: edited: Mario Blunk; BOM: YES; COMMISSIONED: 2014-10-14; FUNCTION: SET1; PART_CODE_BEL: S_PAC_T_PUSH_BUTTON_6X6MM
S1502 = be_switch:PUSH_BUTTON: edited: Mario Blunk; BOM: YES; COMMISSIONED: 2014-10-14; FUNCTION: SET2; PART_CODE_BEL: S_PAC_T_PUSH_BUTTON_6X6MM
S1503 = be_switch:PUSH_BUTTON: edited: Mario Blunk; BOM: YES; COMMISSIONED: 2014-10-14; FUNCTION: SET3; PART_CODE_BEL: S_PAC_T_PUSH_BUTTON_6X6MM
S1504 = be_switch:PUSH_BUTTON: edited: Mario Blunk; BOM: YES; COMMISSIONED: 2014-10-14; FUNCTION: SET4; PART_CODE_BEL: S_PAC_T_PUSH_BUTTON_6X6MM
S1505 = be_switch:PUSH_BUTTON: edited: Mario Blunk; BOM: YES; COMMISSIONED: 2014-10-14; FUNCTION: SET5; PART_CODE_BEL: S_PAC_T_PUSH_BUTTON_6X6MM
S1506 = be_switch:PUSH_BUTTON: edited: Mario Blunk; BOM: YES; COMMISSIONED: 2014-10-14; FUNCTION: SET6; PART_CODE_BEL: S_PAC_T_PUSH_BUTTON_6X6MM
S1507 = be_switch:PUSH_BUTTON: edited: Mario Blunk; BOM: YES; COMMISSIONED: 2014-10-14; FUNCTION: SET7; PART_CODE_BEL: S_PAC_T_PUSH_BUTTON_6X6MM
S1508 = be_switch:PUSH_BUTTON: edited: Mario Blunk; BOM: YES; COMMISSIONED: 2014-10-14; FUNCTION: SET8; PART_CODE_BEL: S_PAC_T_PUSH_BUTTON_6X6MM
T1601 T1602 = be_transistor:P-MOSFET: P-MOSFET transistor device drawn: Mario Blunk / Blunk electronic; BOM: YES; COMMISSIONED: 2013-08-30; PART_CODE_BEL: T_PAC_S_SOT23_VAL_NX2301P
TP1101-TP1127 TP1601-TP1604 TP1607 = be_con_jump:TEST_POINT: test point device drawn: Mario Blunk / Blunk electronic; BOM: NO; COMMISSIONED: 2013-08-30; PART_CODE_BEL: TP_PAC_T_TEST_POINT_SMALL
TP1401 = be_con_jump:TEST_POINT: test point device drawn: Mario Blunk / Blunk electronic; BOM: NO; COMMISSIONED: 2013-08-30; FUNCTION: SCL; PART_CODE_BEL: TP_PAC_T_TEST_POINT_SMALL
TP1402 = be_con_jump:TEST_POINT: test point device drawn: Mario Blunk / Blunk electronic; BOM: NO; COMMISSIONED: 2013-08-30; FUNCTION: SDA; PART_CODE_BEL: TP_PAC_T_TEST_POINT_SMALL
TP1605 TP1606 = be_con_jump:TEST_POINT: test point device drawn: Mario Blunk / Blunk electronic; BOM: NO; COMMISSIONED: 2014-09-03; PART_CODE_BEL: TP_PAC_T_TEST_POINT_SMALL
X1401 = be_con_jump:CLAMP_1X4: drawn: Mario Blunk / Blunk electronic; BOM: YES; COMMISSIONED: 2014-02-26; FUNCTION: PWR P5V IN; PART_CODE_BEL: X_PAC_T_CLAMP_1X4_5mm
X1402 = be_con_jump:MALE_2X13: edited: Mario Blunk; BOM: YES; COMMISSIONED: 2015-02-03; FUNCTION: CTRL; PART_CODE_BEL: X_PAC_T_MALE_2X13_VERTICAL_GRID_2.54mm
X1403 = be_con_jump:MALE_1X3: drawn: Mario Blunk / Blunk electronic; BOM: YES; COMMISSIONED: 2013-08-30; FUNCTION: DEBUG & INSTRUMENTATION; PART_CODE_BEL: X_PAC_T_MALE_1X3_VERTICAL_GRID_2.54MM
X1501 = be_con_jump:MALE_2X13: edited: Mario Blunk; BOM: YES; COMMISSIONED: 2015-02-03; FUNCTION: KEYPAD EXT,; PART_CODE_BEL: X_PAC_T_MALE_2X13_VERTICAL_GRID_2.54mm

## Net classes
1 pwr: width 0.3 mm